# EAGLE design Memory V1.3 (EAGLE 9.6.2)

## Sheet 1 of 6: BUS
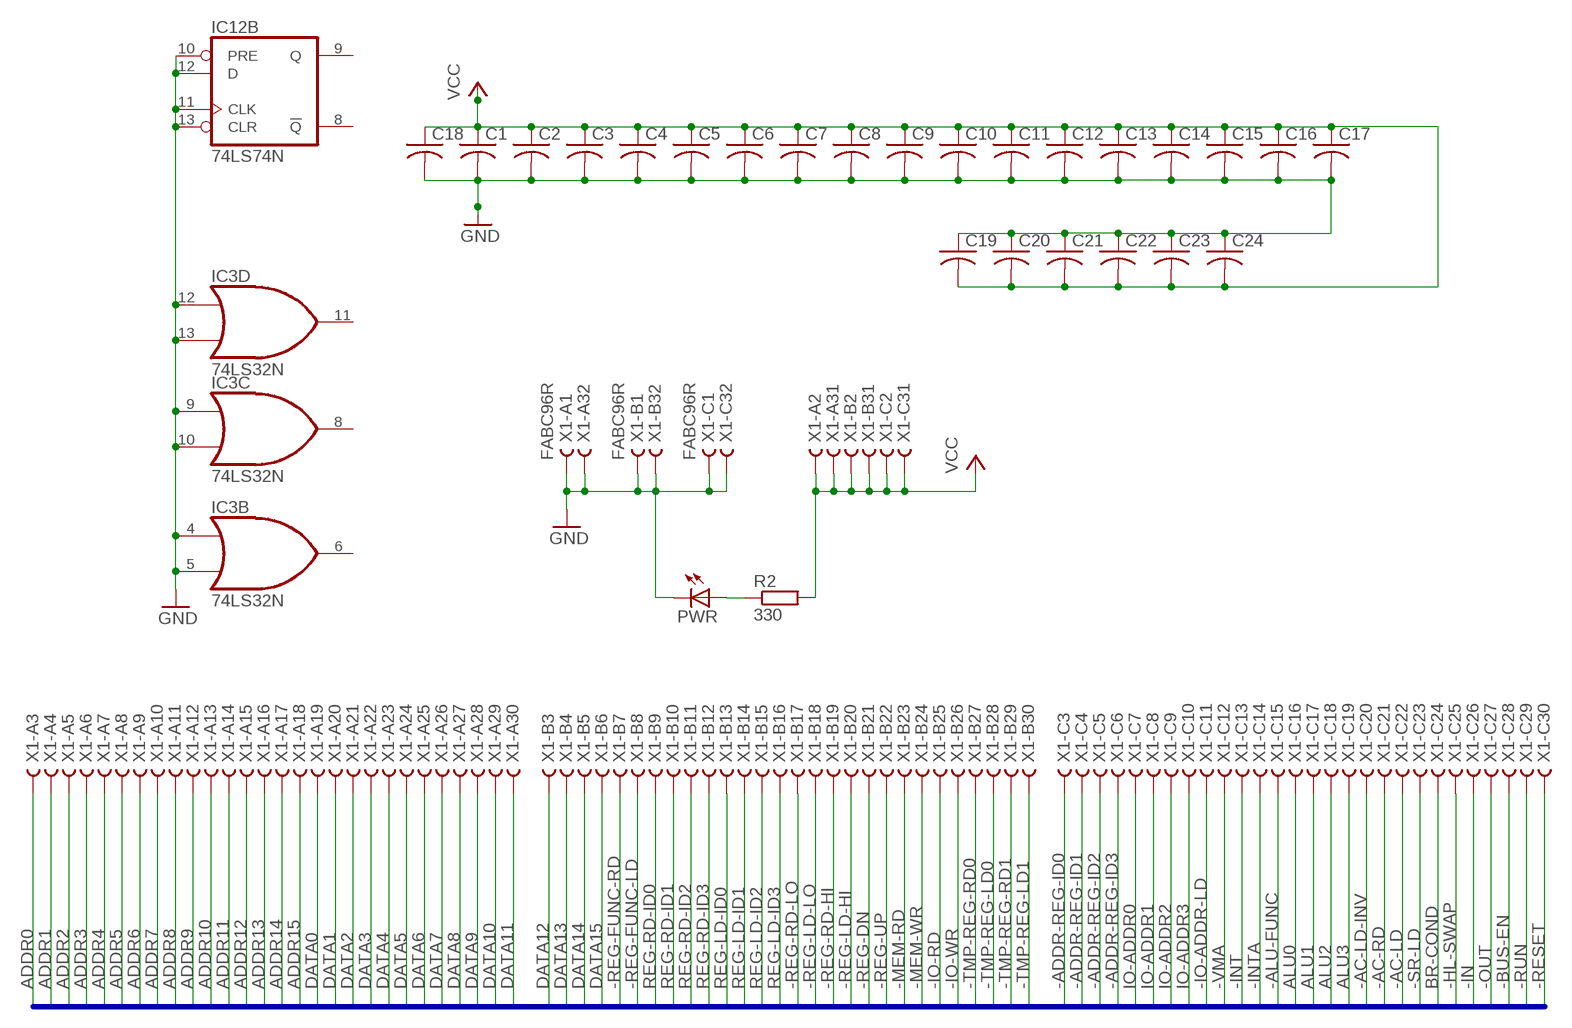
[diagram p0: schematic, sheet 1]

### Parts
C1  C-US025-025X050  [C025-025X050]
C2  C-US025-025X050  [C025-025X050]
C3  C-US025-025X050  [C025-025X050]
C4  C-US025-025X050  [C025-025X050]
C5  C-US025-025X050  [C025-025X050]
C6  C-US025-025X050  [C025-025X050]
C7  C-US025-025X050  [C025-025X050]
C8  C-US025-025X050  [C025-025X050]
C9  C-US025-025X050  [C025-025X050]
C10  C-US025-025X050  [C025-025X050]
C11  C-US025-025X050  [C025-025X050]
C12  C-US025-025X050  [C025-025X050]
C13  C-US025-025X050  [C025-025X050]
C14  C-US025-025X050  [C025-025X050]
C15  C-US025-025X050  [C025-025X050]
C16  C-US025-025X050  [C025-025X050]
C17  C-US025-025X050  [C025-025X050]
C18  C-US025-025X050  [C025-025X050]
C19  C-US025-025X050  [C025-025X050]
C20  C-US025-025X050  [C025-025X050]
C21  C-US025-025X050  [C025-025X050]
C22  C-US025-025X050  [C025-025X050]
C23  C-US025-025X050  [C025-025X050]
C24  C-US025-025X050  [C025-025X050]
IC3  74LS32N  [DIL14]
IC12  74LS74N  [DIL14]
PWR  LED5MM  [LED5MM]
R2  330  R0207/10  [0207/10]
X1  FABC96R  [FABC96R]

### Nets
-AC-LD: X1.C22
-AC-LD-INV: X1.C20
-AC-RD: X1.C21
-ADDR-REG-ID0: X1.C3
-ADDR-REG-ID1: X1.C4
-ADDR-REG-ID2: X1.C5
-ADDR-REG-ID3: X1.C6
-ALU-FUNC: X1.C15
-BUS-EN: X1.C28 ; also sheet 2
-HL-SWAP: X1.C25
-IN: X1.C26
-INT: X1.C13
-INTA: X1.C14
-IO-ADDR-LD: X1.C11
-IO-RD: X1.B25
-IO-WR: X1.B26
-MEM-RD: X1.B23 ; also sheet 3,5
-MEM-WR: X1.B24 ; also sheet 3
-OUT: X1.C27
-REG-DN: X1.B21
-REG-FUNC-LD: X1.B8
-REG-FUNC-RD: X1.B7
-REG-LD-HI: X1.B20
-REG-LD-LO: X1.B18
-REG-RD-HI: X1.B19
-REG-RD-LO: X1.B17
-REG-UP: X1.B22
-RESET: X1.C30 ; also sheet 2
-RUN: X1.C29
-SR-LD: X1.C23
-TMP-REG-LD0: X1.B28 ; also sheet 6
-TMP-REG-LD1: X1.B30 ; also sheet 6
-TMP-REG-RD0: X1.B27 ; also sheet 6
-TMP-REG-RD1: X1.B29 ; also sheet 6
-VMA: X1.C12 ; also sheet 2,3,5
ADDR0: X1.A3 ; also sheet 4
ADDR1: X1.A4 ; also sheet 4
ADDR2: X1.A5 ; also sheet 4
ADDR3: X1.A6 ; also sheet 4
ADDR4: X1.A7 ; also sheet 4
ADDR5: X1.A8 ; also sheet 4
ADDR6: X1.A9 ; also sheet 4
ADDR7: X1.A10 ; also sheet 4
ADDR8: X1.A11 ; also sheet 4
ADDR9: X1.A12 ; also sheet 4
ADDR10: X1.A13 ; also sheet 4
ADDR11: X1.A14 ; also sheet 4
ADDR12: X1.A15 ; also sheet 4
ADDR13: X1.A16 ; also sheet 4
ADDR14: X1.A17 ; also sheet 4
ADDR15: X1.A18 ; also sheet 2,4
ALU0: X1.C16
ALU1: X1.C17
ALU2: X1.C18
ALU3: X1.C19
BR-COND: X1.C24
DATA0: X1.A19 ; also sheet 5,6
DATA1: X1.A20 ; also sheet 5,6
DATA2: X1.A21 ; also sheet 5,6
DATA3: X1.A22 ; also sheet 5,6
DATA4: X1.A23 ; also sheet 5,6
DATA5: X1.A24 ; also sheet 5,6
DATA6: X1.A25 ; also sheet 5,6
DATA7: X1.A26 ; also sheet 5,6
DATA8: X1.A27 ; also sheet 6
DATA9: X1.A28 ; also sheet 6
DATA10: X1.A29 ; also sheet 6
DATA11: X1.A30 ; also sheet 6
DATA12: X1.B3 ; also sheet 6
DATA13: X1.B4 ; also sheet 6
DATA14: X1.B5 ; also sheet 6
DATA15: X1.B6 ; also sheet 6
GND: C1.2 C2.2 C3.2 C4.2 C5.2 C6.2 C7.2 C8.2 C9.2 C10.2 C11.2 C12.2 C13.2 C14.2 C15.2 C16.2 C17.2 C18.2 C19.1 C20.1 C21.1 C22.1 C23.1 C24.1 IC3.4(B:I0) IC3.5(B:I1) IC3.9(C:I0) IC3.10(C:I1) IC3.12(D:I0) IC3.13(D:I1) IC12.10(B:PRE) IC12.11(B:CLK) IC12.12(B:D) IC12.13(B:CLR) PWR.K(C) X1.A1 X1.A32 X1.B1 X1.B32 X1.C1 X1.C32 ; also sheet 2,3,4,6
IO-ADDR0: X1.C7
IO-ADDR1: X1.C8
IO-ADDR2: X1.C9
IO-ADDR3: X1.C10
N$11: PWR.A R2.1
REG-LD-ID0: X1.B13
REG-LD-ID1: X1.B14
REG-LD-ID2: X1.B15
REG-LD-ID3: X1.B16
REG-RD-ID0: X1.B9
REG-RD-ID1: X1.B10
REG-RD-ID2: X1.B11
REG-RD-ID3: X1.B12
VCC: C1.1 C2.1 C3.1 C4.1 C5.1 C6.1 C7.1 C8.1 C9.1 C10.1 C11.1 C12.1 C13.1 C14.1 C15.1 C16.1 C17.1 C18.1 C19.2 C20.2 C21.2 C22.2 C23.2 C24.2 R2.2 X1.A2 X1.A31 X1.B2 X1.B31 X1.C2 X1.C31 ; also sheet 2,3,4
Unconnected: IC3.6(B:O) IC3.8(C:O) IC3.11(D:O) IC12.8(B:!Q) IC12.9(B:Q)

### Buses
MAINBUS:-AC-LD,-AC-LD-INV,-AC-RD,ADDR[0..15],-ADDR-REG-LD[0..1],-ADDR-REG-RD[0..1],ALU[0..3],-ALU-FUNC,BR-COND,-BUS-EN,DATA[0..15],-HL-SWAP,-IN,-INT,-INTA,IO-ADDR[0..3],-IO-ADDR-LD,-IO-RD,-IO-WR,-MEM-RD,-MEM-WR,-OUT,-REG-DN,-REG-FUNC-LD,-REG-FUNC-RD,-REG-LD-HI,REG-LD-ID[0..3],-REG-LD-LO,-REG-RD-HI,REG-RD-ID[0..3],-REG-RD-LO,-REG-UP,-RESET,-RUN,-SR-LD,-TMP-REG-LD[0..1],-TMP-REG-RD[0..1],-VMA

## Sheet 2 of 6: Memory Select
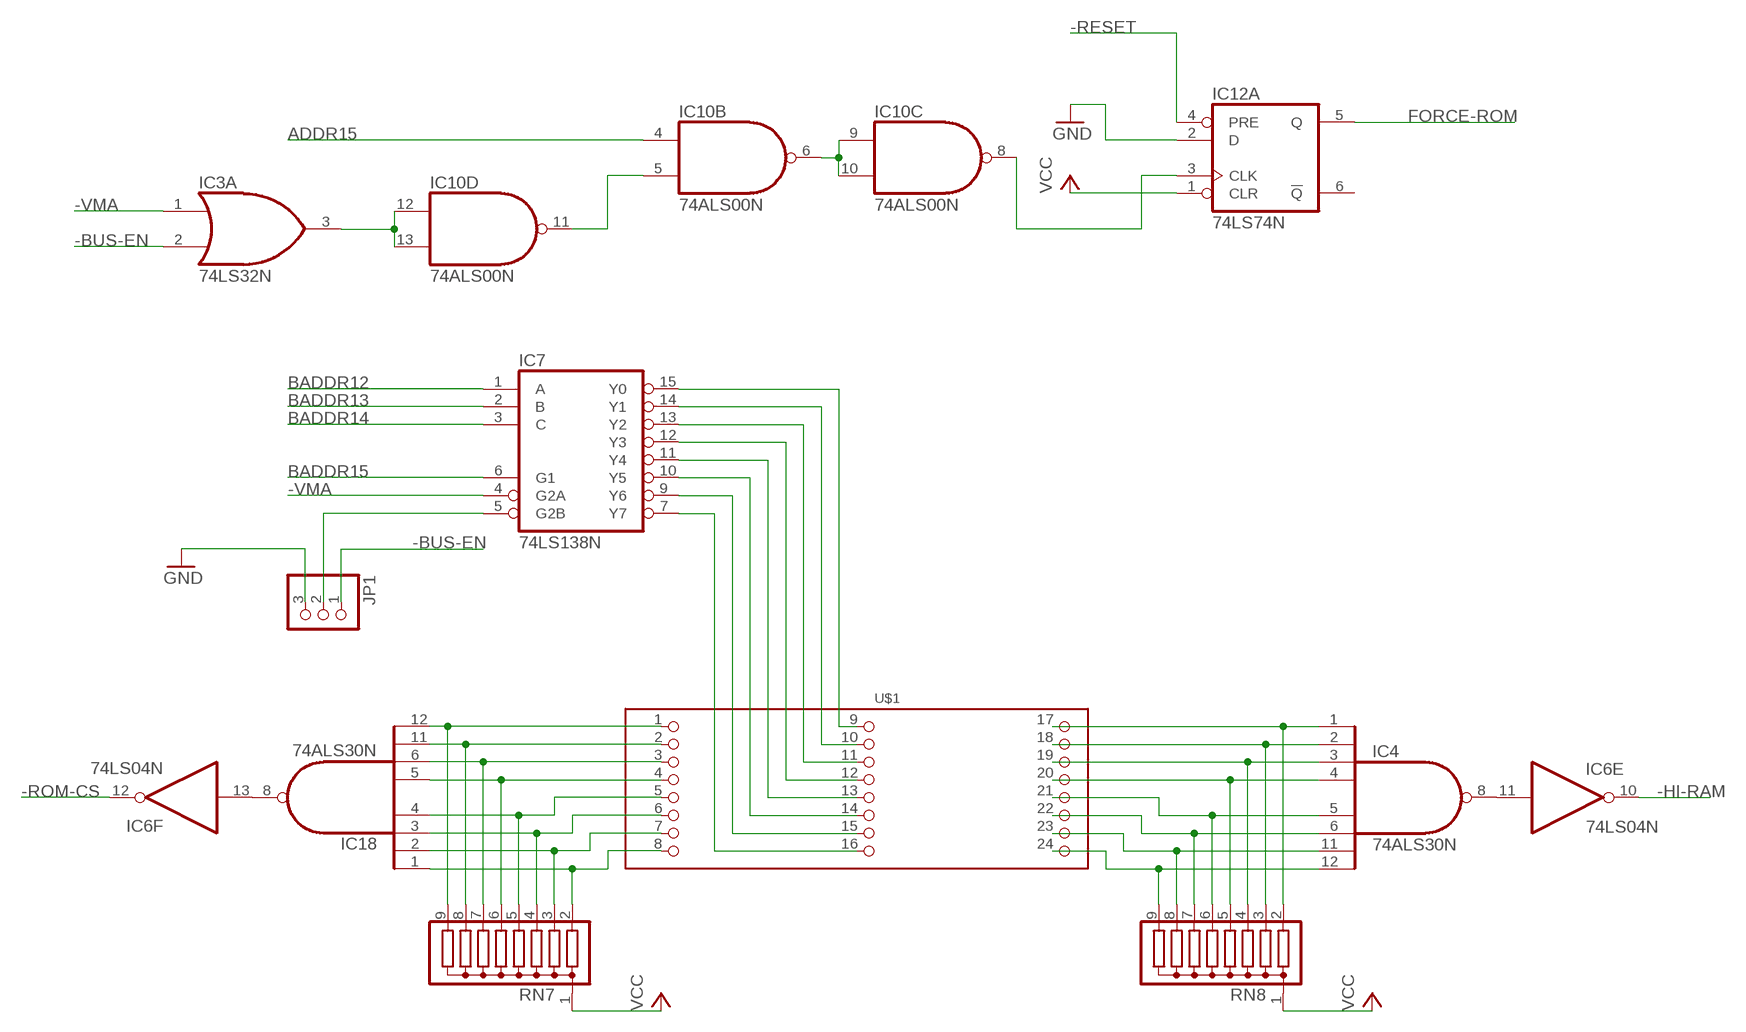
[diagram p1: schematic, sheet 2]

### Parts
IC4  74ALS30N  [DIL14]
IC6  74LS04N  [DIL14]
IC7  74LS138N  [DIL16]
IC10  74ALS00N  [DIL14]
IC18  74ALS30N  [DIL14]
JP1  PINHD-1X3  [1X03]
RN7  G08R  [SIL9]
RN8  G08R  [SIL9]
U$1  PIN_3X8  [PIN_3X8]

### Nets
-BUS-EN: IC3.2(A:I1) JP1.1 ; also sheet 1
-HI-RAM: IC6.10(E:O) ; also sheet 3
-RESET: IC12.4(A:PRE) ; also sheet 1
-ROM-CS: IC6.12(F:O) ; also sheet 3
-VMA: IC3.1(A:I0) IC7.4(G2A) ; also sheet 1,3,5
ADDR15: IC10.4(B:I0) ; also sheet 1,4
BADDR12: IC7.1(A) ; also sheet 3,4
BADDR13: IC7.2(B) ; also sheet 3,4
BADDR14: IC7.3(C) ; also sheet 3,4
BADDR15: IC7.6(G1) ; also sheet 3,4
FORCE-ROM: IC12.5(A:Q) ; also sheet 4
GND: IC12.2(A:D) JP1.3 ; also sheet 1,3,4,6
N$1: IC6.13(F:I) IC18.8(O)
N$5: IC4.1(I0) RN8.2 U$1.17
N$6: IC4.2(I1) RN8.3 U$1.18
N$7: IC4.3(I2) RN8.4 U$1.19
N$8: IC4.4(I3) RN8.5 U$1.20
N$9: IC4.5(I4) RN8.6 U$1.21
N$10: IC4.6(I5) RN8.7 U$1.22
N$14: IC4.8(O) IC6.11(E:I)
N$19: IC10.8(C:O) IC12.3(A:CLK)
N$20: IC10.6(B:O) IC10.9(C:I0) IC10.10(C:I1)
N$22: IC10.5(B:I1) IC10.11(D:O)
N$24: IC7.5(G2B) JP1.2
N$25: IC3.3(A:O) IC10.12(D:I0) IC10.13(D:I1)
N$26: IC4.11(I6) RN8.8 U$1.23
N$27: IC4.12(I7) RN8.9 U$1.24
N$28: IC18.12(I7) RN7.9 U$1.1
N$29: IC18.11(I6) RN7.8 U$1.2
N$30: IC18.6(I5) RN7.7 U$1.3
N$31: IC18.5(I4) RN7.6 U$1.4
N$32: IC18.1(I0) RN7.2 U$1.8
N$34: IC18.2(I1) RN7.3 U$1.7
N$35: IC18.3(I2) RN7.4 U$1.6
N$36: IC7.7(Y7) U$1.16
N$37: IC7.9(Y6) U$1.15
N$38: IC7.10(Y5) U$1.14
N$39: IC7.11(Y4) U$1.13
N$40: IC7.12(Y3) U$1.12
N$41: IC7.13(Y2) U$1.11
N$42: IC7.14(Y1) U$1.10
N$43: IC7.15(Y0) U$1.9
N$44: IC18.4(I3) RN7.5 U$1.5
VCC: IC12.1(A:CLR) RN7.1 RN8.1 ; also sheet 1,3,4
Unconnected: IC12.6(A:!Q)

## Sheet 3 of 6: Memory
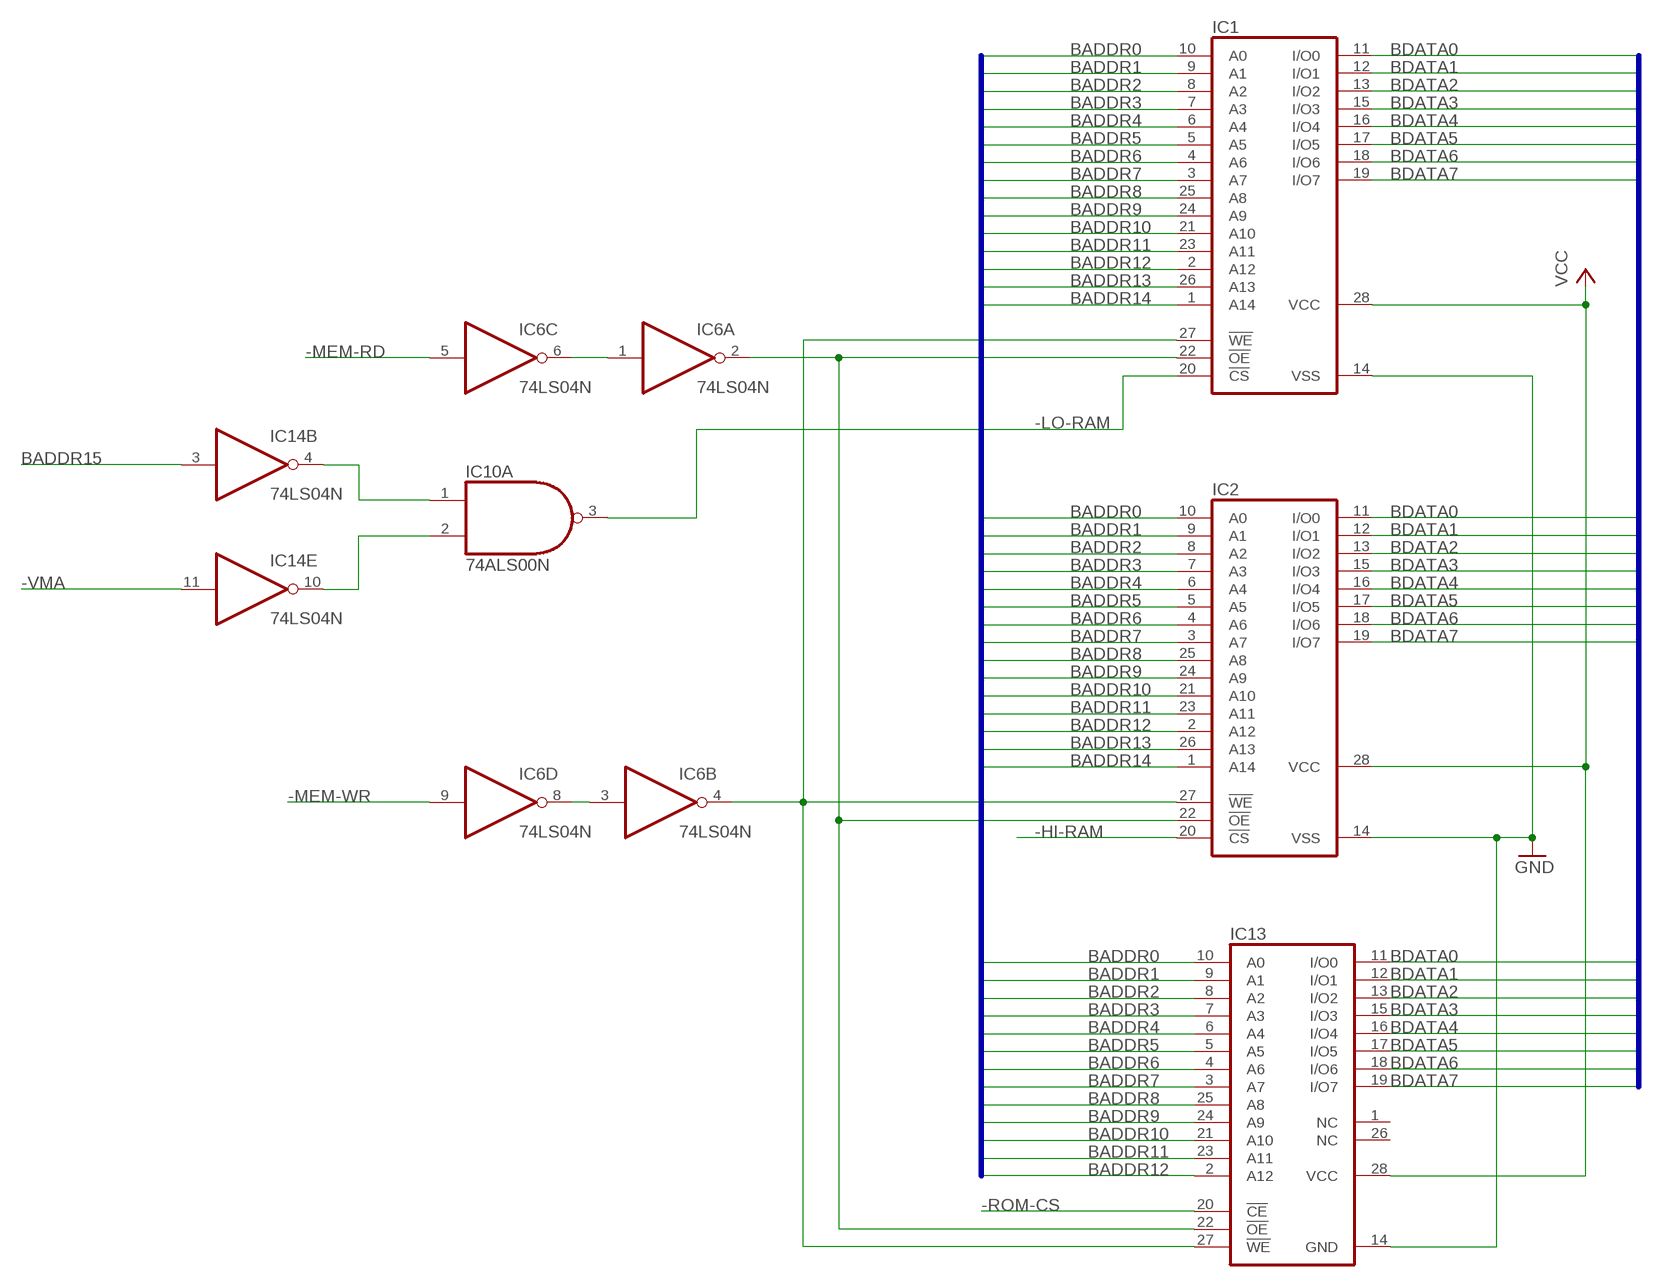
[diagram p2: schematic, sheet 3]

### Parts
IC1  62256P  [DIL28-6]
IC2  62256P  [DIL28-6]
IC13  28C64C  [DIL28-6]
IC14  74LS04N  [DIL14]

### Nets
-HI-RAM: IC2.20(!CS) ; also sheet 2
-LO-RAM: IC1.20(!CS) IC10.3(A:O)
-MEM-RD: IC6.5(C:I) ; also sheet 1,5
-MEM-WR: IC6.9(D:I) ; also sheet 1
-ROM-CS: IC13.20(!CE) ; also sheet 2
-VMA: IC14.11(E:I) ; also sheet 1,2,5
BADDR0: IC1.10(A0) IC2.10(A0) IC13.10(A0) ; also sheet 4
BADDR1: IC1.9(A1) IC2.9(A1) IC13.9(A1) ; also sheet 4
BADDR2: IC1.8(A2) IC2.8(A2) IC13.8(A2) ; also sheet 4
BADDR3: IC1.7(A3) IC2.7(A3) IC13.7(A3) ; also sheet 4
BADDR4: IC1.6(A4) IC2.6(A4) IC13.6(A4) ; also sheet 4
BADDR5: IC1.5(A5) IC2.5(A5) IC13.5(A5) ; also sheet 4
BADDR6: IC1.4(A6) IC2.4(A6) IC13.4(A6) ; also sheet 4
BADDR7: IC1.3(A7) IC2.3(A7) IC13.3(A7) ; also sheet 4
BADDR8: IC1.25(A8) IC2.25(A8) IC13.25(A8) ; also sheet 4
BADDR9: IC1.24(A9) IC2.24(A9) IC13.24(A9) ; also sheet 4
BADDR10: IC1.21(A10) IC2.21(A10) IC13.21(A10) ; also sheet 4
BADDR11: IC1.23(A11) IC2.23(A11) IC13.23(A11) ; also sheet 4
BADDR12: IC1.2(A12) IC2.2(A12) IC13.2(A12) ; also sheet 2,4
BADDR13: IC1.26(A13) IC2.26(A13) ; also sheet 2,4
BADDR14: IC1.1(A14) IC2.1(A14) ; also sheet 2,4
BADDR15: IC14.3(B:I) ; also sheet 2,4
BDATA0: IC1.11(I/O0) IC2.11(I/O0) IC13.11(I/O0) ; also sheet 5
BDATA1: IC1.12(I/O1) IC2.12(I/O1) IC13.12(I/O1) ; also sheet 5
BDATA2: IC1.13(I/O2) IC2.13(I/O2) IC13.13(I/O2) ; also sheet 5
BDATA3: IC1.15(I/O3) IC2.15(I/O3) IC13.15(I/O3) ; also sheet 5
BDATA4: IC1.16(I/O4) IC2.16(I/O4) IC13.16(I/O4) ; also sheet 5
BDATA5: IC1.17(I/O5) IC2.17(I/O5) IC13.17(I/O5) ; also sheet 5
BDATA6: IC1.18(I/O6) IC2.18(I/O6) IC13.18(I/O6) ; also sheet 5
BDATA7: IC1.19(I/O7) IC2.19(I/O7) IC13.19(I/O7) ; also sheet 5
GND: IC1.14(VSS) IC2.14(VSS) IC13.14(GND) ; also sheet 1,2,4,6
MEM-RD: IC6.1(A:I) IC6.6(C:O)
N$2: IC6.3(B:I) IC6.8(D:O)
N$3: IC1.22(!OE) IC2.22(!OE) IC6.2(A:O) IC13.22(!OE)
N$4: IC1.27(!WE) IC2.27(!WE) IC6.4(B:O) IC13.27(!WE)
N$12: IC10.2(A:I1) IC14.10(E:O)
N$13: IC10.1(A:I0) IC14.4(B:O)
VCC: IC1.28(VCC) IC2.28(VCC) IC13.28(VCC) ; also sheet 1,2,4
Unconnected: IC13.1(NC) IC13.26(NC) IC14.5(C:I) IC14.6(C:O) IC14.8(D:O) IC14.9(D:I)

### Buses
BADDR[0..15]
BDATA[0..7]

## Sheet 4 of 6: Adress Buffering
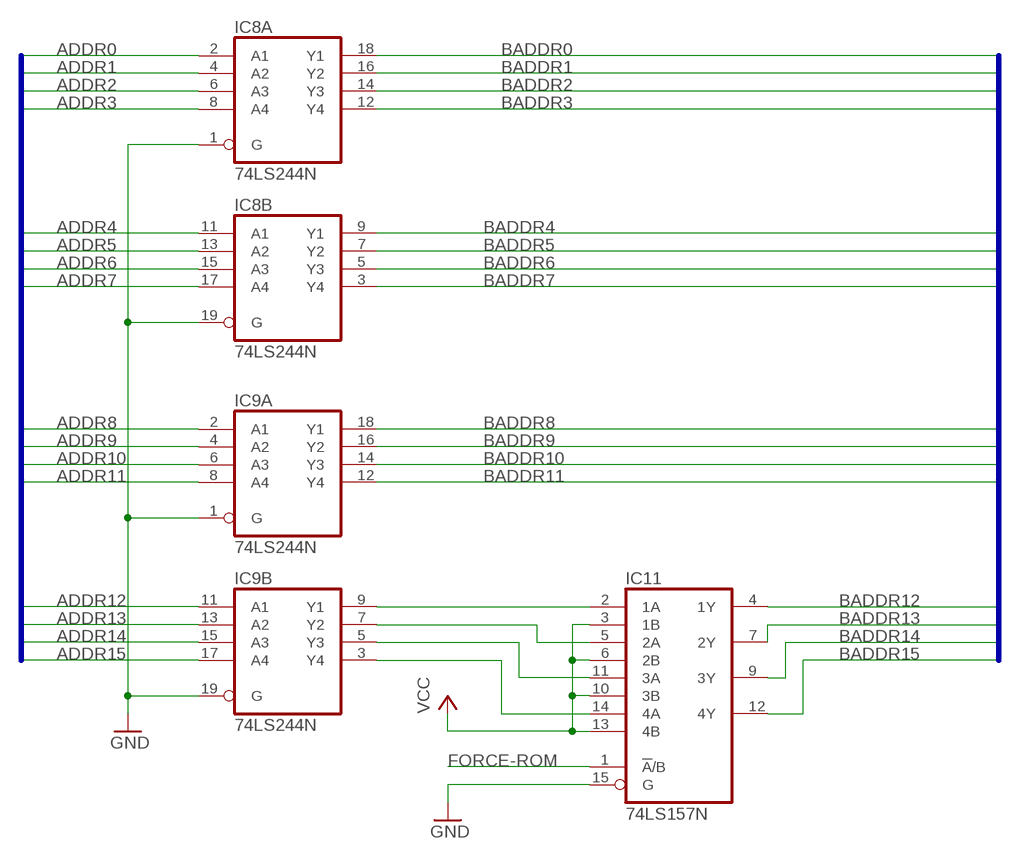
[diagram p3: schematic, sheet 4]

### Parts
IC8  74LS244N  [DIL20]
IC9  74LS244N  [DIL20]
IC11  74LS157N  [DIL16]

### Nets
ADDR0: IC8.2(A:A1) ; also sheet 1
ADDR1: IC8.4(A:A2) ; also sheet 1
ADDR2: IC8.6(A:A3) ; also sheet 1
ADDR3: IC8.8(A:A4) ; also sheet 1
ADDR4: IC8.11(B:A1) ; also sheet 1
ADDR5: IC8.13(B:A2) ; also sheet 1
ADDR6: IC8.15(B:A3) ; also sheet 1
ADDR7: IC8.17(B:A4) ; also sheet 1
ADDR8: IC9.2(A:A1) ; also sheet 1
ADDR9: IC9.4(A:A2) ; also sheet 1
ADDR10: IC9.6(A:A3) ; also sheet 1
ADDR11: IC9.8(A:A4) ; also sheet 1
ADDR12: IC9.11(B:A1) ; also sheet 1
ADDR13: IC9.13(B:A2) ; also sheet 1
ADDR14: IC9.15(B:A3) ; also sheet 1
ADDR15: IC9.17(B:A4) ; also sheet 1,2
BADDR0: IC8.18(A:Y1) ; also sheet 3
BADDR1: IC8.16(A:Y2) ; also sheet 3
BADDR2: IC8.14(A:Y3) ; also sheet 3
BADDR3: IC8.12(A:Y4) ; also sheet 3
BADDR4: IC8.9(B:Y1) ; also sheet 3
BADDR5: IC8.7(B:Y2) ; also sheet 3
BADDR6: IC8.5(B:Y3) ; also sheet 3
BADDR7: IC8.3(B:Y4) ; also sheet 3
BADDR8: IC9.18(A:Y1) ; also sheet 3
BADDR9: IC9.16(A:Y2) ; also sheet 3
BADDR10: IC9.14(A:Y3) ; also sheet 3
BADDR11: IC9.12(A:Y4) ; also sheet 3
BADDR12: IC11.4(1Y) ; also sheet 2,3
BADDR13: IC11.7(2Y) ; also sheet 2,3
BADDR14: IC11.9(3Y) ; also sheet 2,3
BADDR15: IC11.12(4Y) ; also sheet 2,3
FORCE-ROM: IC11.1(!A!/B) ; also sheet 2
GND: IC8.1(A:G) IC8.19(B:G) IC9.1(A:G) IC9.19(B:G) IC11.15(G) ; also sheet 1,2,3,6
N$15: IC9.9(B:Y1) IC11.2(1A)
N$16: IC9.7(B:Y2) IC11.5(2A)
N$17: IC9.5(B:Y3) IC11.11(3A)
N$18: IC9.3(B:Y4) IC11.14(4A)
VCC: IC11.3(1B) IC11.6(2B) IC11.10(3B) IC11.13(4B) ; also sheet 1,2,3

### Buses
ADDR0,ADDR1,ADDR2,ADDR3,ADDR4,ADDR5,ADDR6,ADDR7,ADDR8,ADDR9,ADDR10,ADDR11,ADDR12,ADDR13,ADDR14,ADDR15
BADDR[0..15]

## Sheet 5 of 6: Data Buffer
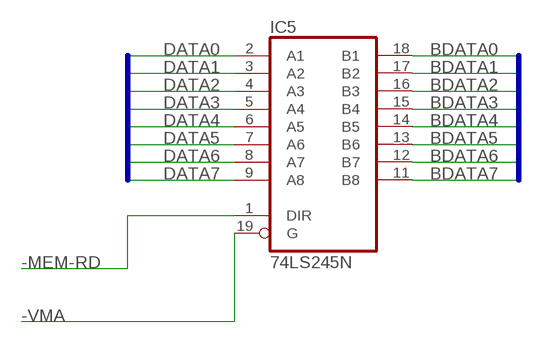
[diagram p4: schematic, sheet 5]

### Parts
IC5  74LS245N  [DIL20]

### Nets
-MEM-RD: IC5.1(DIR) ; also sheet 1,3
-VMA: IC5.19(G) ; also sheet 1,2,3
BDATA0: IC5.18(B1) ; also sheet 3
BDATA1: IC5.17(B2) ; also sheet 3
BDATA2: IC5.16(B3) ; also sheet 3
BDATA3: IC5.15(B4) ; also sheet 3
BDATA4: IC5.14(B5) ; also sheet 3
BDATA5: IC5.13(B6) ; also sheet 3
BDATA6: IC5.12(B7) ; also sheet 3
BDATA7: IC5.11(B8) ; also sheet 3
DATA0: IC5.2(A1) ; also sheet 1,6
DATA1: IC5.3(A2) ; also sheet 1,6
DATA2: IC5.4(A3) ; also sheet 1,6
DATA3: IC5.5(A4) ; also sheet 1,6
DATA4: IC5.6(A5) ; also sheet 1,6
DATA5: IC5.7(A6) ; also sheet 1,6
DATA6: IC5.8(A7) ; also sheet 1,6
DATA7: IC5.9(A8) ; also sheet 1,6

### Buses
DATA[0..7]
BDATA0,BDATA1,BDATA2,BDATA3,BDATA4,BDATA5,BDATA6,BDATA7

## Sheet 6 of 6
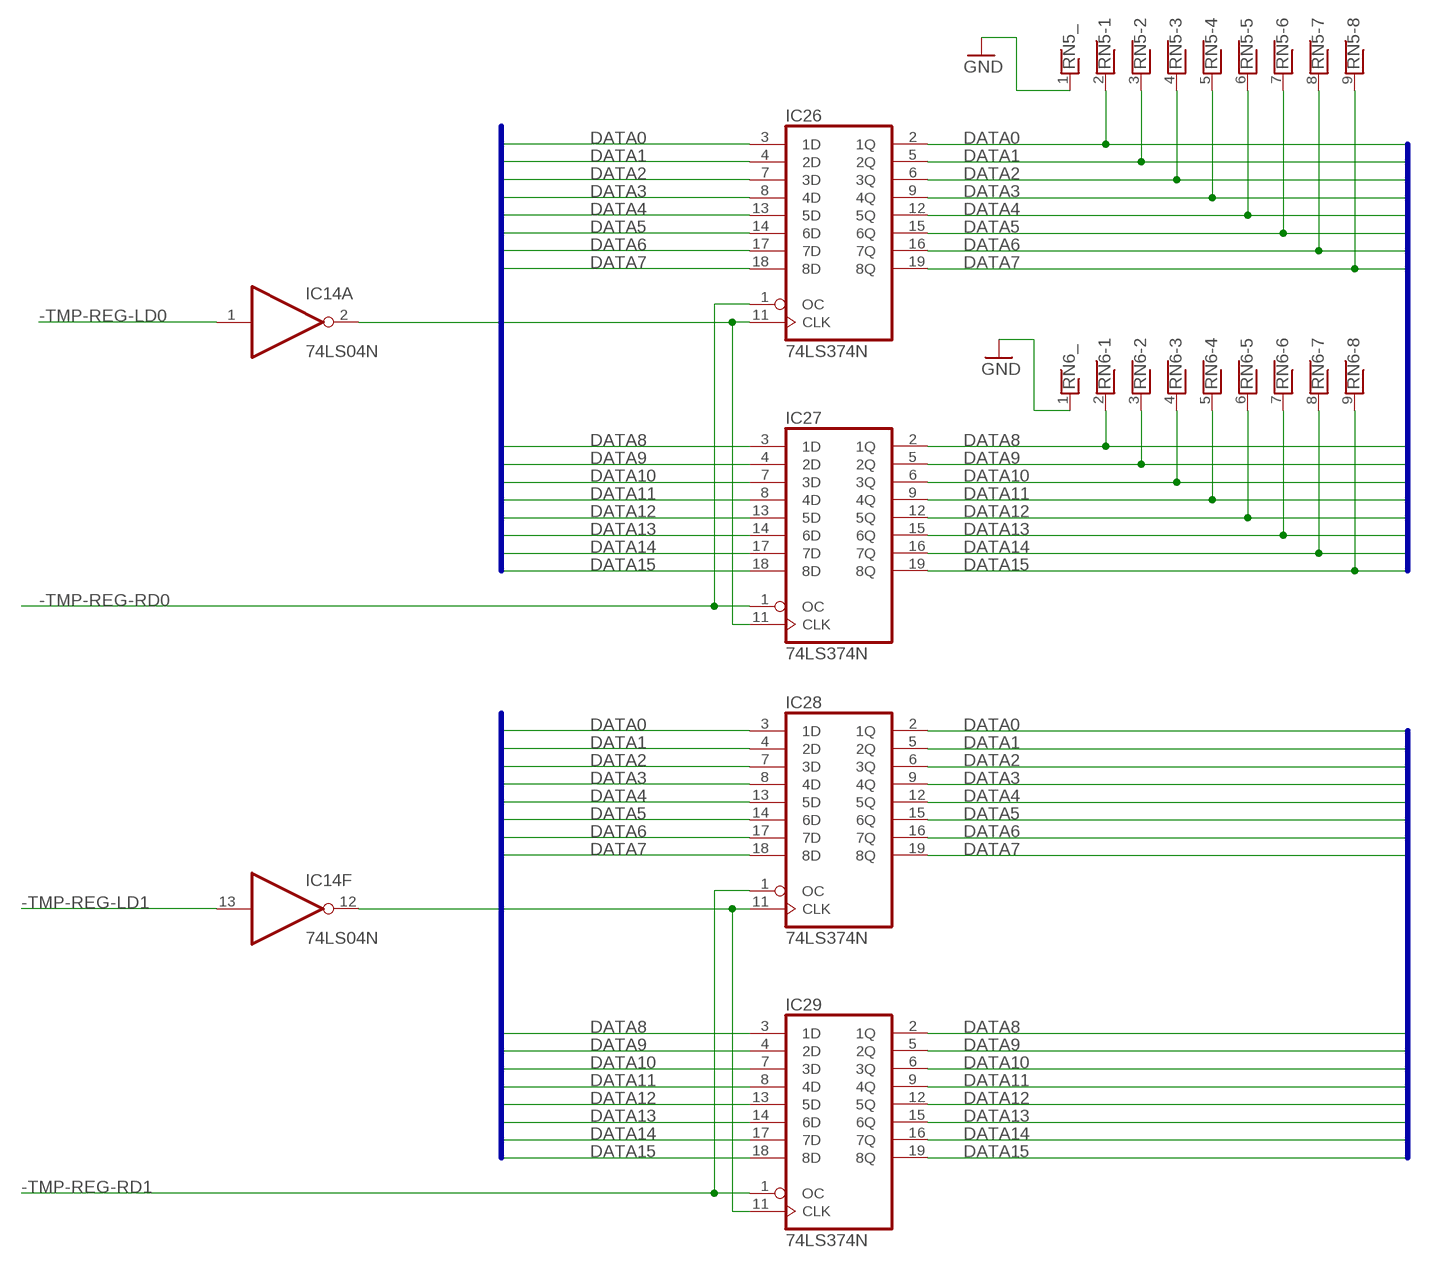
[diagram p5: schematic, sheet 6]

### Parts
IC26  74LS374N  [DIL20]
IC27  74LS374N  [DIL20]
IC28  74LS374N  [DIL20]
IC29  74LS374N  [DIL20]
RN5  RNX8  [RN-9]
RN6  RNX8  [RN-9]

### Nets
-TMP-REG-LD0: IC14.1(A:I) ; also sheet 1
-TMP-REG-LD1: IC14.13(F:I) ; also sheet 1
-TMP-REG-RD0: IC26.1(OC) IC27.1(OC) ; also sheet 1
-TMP-REG-RD1: IC28.1(OC) IC29.1(OC) ; also sheet 1
DATA0: IC26.2(1Q) IC26.3(1D) IC28.2(1Q) IC28.3(1D) RN5.2 ; also sheet 1,5
DATA1: IC26.4(2D) IC26.5(2Q) IC28.4(2D) IC28.5(2Q) RN5.3 ; also sheet 1,5
DATA2: IC26.6(3Q) IC26.7(3D) IC28.6(3Q) IC28.7(3D) RN5.4 ; also sheet 1,5
DATA3: IC26.8(4D) IC26.9(4Q) IC28.8(4D) IC28.9(4Q) RN5.5 ; also sheet 1,5
DATA4: IC26.12(5Q) IC26.13(5D) IC28.12(5Q) IC28.13(5D) RN5.6 ; also sheet 1,5
DATA5: IC26.14(6D) IC26.15(6Q) IC28.14(6D) IC28.15(6Q) RN5.7 ; also sheet 1,5
DATA6: IC26.16(7Q) IC26.17(7D) IC28.16(7Q) IC28.17(7D) RN5.8 ; also sheet 1,5
DATA7: IC26.18(8D) IC26.19(8Q) IC28.18(8D) IC28.19(8Q) RN5.9 ; also sheet 1,5
DATA8: IC27.2(1Q) IC27.3(1D) IC29.2(1Q) IC29.3(1D) RN6.2 ; also sheet 1
DATA9: IC27.4(2D) IC27.5(2Q) IC29.4(2D) IC29.5(2Q) RN6.3 ; also sheet 1
DATA10: IC27.6(3Q) IC27.7(3D) IC29.6(3Q) IC29.7(3D) RN6.4 ; also sheet 1
DATA11: IC27.8(4D) IC27.9(4Q) IC29.8(4D) IC29.9(4Q) RN6.5 ; also sheet 1
DATA12: IC27.12(5Q) IC27.13(5D) IC29.12(5Q) IC29.13(5D) RN6.6 ; also sheet 1
DATA13: IC27.14(6D) IC27.15(6Q) IC29.14(6D) IC29.15(6Q) RN6.7 ; also sheet 1
DATA14: IC27.16(7Q) IC27.17(7D) IC29.16(7Q) IC29.17(7D) RN6.8 ; also sheet 1
DATA15: IC27.18(8D) IC27.19(8Q) IC29.18(8D) IC29.19(8Q) RN6.9 ; also sheet 1
GND: RN5.1 RN6.1 ; also sheet 1,2,3,4
N$33: IC14.2(A:O) IC26.11(CLK) IC27.11(CLK)
N$47: IC14.12(F:O) IC28.11(CLK) IC29.11(CLK)

### Buses
DATABUS:DATA[0..15]

## Power pins joined to a net without a drawn wire
GND: IC3.7(P:GND) IC4.7(GND) IC5.10(GND) IC6.7(P:GND) IC7.8(GND) IC8.10(P:GND) IC9.10(P:GND) IC10.7(P:GND) IC11.8(GND) IC12.7(P:GND) IC14.7(P:GND) IC18.7(GND) IC26.10(GND) IC27.10(GND) IC28.10(GND) IC29.10(GND)
VCC: IC3.14(P:VCC) IC4.14(VCC) IC5.20(VCC) IC6.14(P:VCC) IC7.16(VCC) IC8.20(P:VCC) IC9.20(P:VCC) IC10.14(P:VCC) IC11.16(VCC) IC12.14(P:VCC) IC14.14(P:VCC) IC18.14(VCC) IC26.20(VCC) IC27.20(VCC) IC28.20(VCC) IC29.20(VCC)

## Library data of the parts
C1-C24 = adafruit:C-US: CAPACITOR, American symbol
IC1 IC2 = memory-hitachi:62256P: MEMORY; OC_FARNELL: unknown; OC_NEWARK: unknown
IC3 = 74xx-us:74*32: Quad 2-input OR gate
IC4 IC18 = 74xx-us:74*30: 8-input NAND gate
IC5 = adafruit:74*245: Octal BUS TRANSCEIVER, 3-state
IC6 IC14 = 74xx-us:74*04: Hex INVERTER
IC7 = 74xx-us:74*138: 3-line to 8-line DECODER/DEMULTIPLEXER
IC8 IC9 = 74xx-us:74*244: Octal BUFFER and LINE DRIVER, 3-state
IC10 = 74xx-us:74*00: Quad 2-input NAND gate
IC11 = 74xx-us:74*157: Quadruple 2-line to 1-line data SELECTOR/MULTIPLEXER
IC12 = 74xx-us:74*74: Dual D type positive edge triggered FLIP FLOP, preset and clear
IC13 = memory-nec:28C64C: MEMORY; MPN: AT28C64B-15PU; OC_FARNELL: 1095784; OC_NEWARK: 96K6557
IC26-IC29 = 74xx-us:74*374: Octal D type transparent LATCH, edge triggered
JP1 = pinhead:PINHD-1X3: PIN HEADER
PWR = led:LED: LED OSRAM: - CHIPLED LG R971, LG N971, LY N971, LG Q971, LY Q971, LO R971, LY R971 LH N974, LH R974 LS Q976, LO Q976, LY Q976 LO Q996 - Hyper CHIPLED LW Q18S LB Q993, LB Q99A, LB R99A - SideLED LS A670, LO A670, LY A670, LG A670, LP A670 LB A673, LV A673, LT A673, LW A673 LH A674 LY A675 LS A676, LA A676, LO A676, LY A676, LW A676 LS A679, LY A679, LG A679 - Hyper Micro SIDELED® LS Y876, LA Y876, LO Y876, LY Y876 LT Y87S - SmartLED LW L88C, LW L88S LB L89C, LB L89S, LG L890 LS L89K, LO L89K, LY L89K LS L896, LA L896, LO L896, LY L896 - TOPLED LS T670, LO T670, LY T670, LG T670, LP T670 LSG T670, LSP T670, LSY T670, LOP T670, LYG T670 LG T671, LOG T671, LSG T671 LB T673, LV T673, LT T673, LW T673 LH T674 LS T676, LA T676, LO T676, LY T676, LB T676, LH T676, LSB T676, LW T676 LB T67C, LV T67C, LT T67C, LS T67K, LO T67K, LY T67K, LW E67C LS E67B, LA E67B, LO E67B, LY E67B, LB E67C, LV E67C, LT E67C LW T67C LS T679, LY T679, LG T679 LS T770, LO T770, LY T770, LG T770, LP T770 LB T773, LV T773, LT T773, LW T773 LH T774 LS E675, LA E675, LY E675, LS T675 LS T776, LA T776, LO T776, LY T776, LB T776 LHGB T686 LT T68C, LB T68C - Hyper Mini TOPLED® LB M676 - Mini TOPLED Santana® LG M470 LS M47K, LO M47K, LY M47K Source: http://www.osram.convergy.de LUXEON: - LUMILED® LXK2-PW12-R00, LXK2-PW12-S00, LXK2-PW14-U00, LXK2-PW14-V00 LXK2-PM12-R00, LXK2-PM12-S00, LXK2-PM14-U00 LXK2-PE12-Q00, LXK2-PE12-R00, LXK2-PE12-S00, LXK2-PE14-T00, LXK2-PE14-U00 LXK2-PB12-K00, LXK2-PB12-L00, LXK2-PB12-M00, LXK2-PB14-N00, LXK2-PB14-P00, LXK2-PB14-Q00 LXK2-PR12-L00, LXK2-PR12-M00, LXK2-PR14-Q00, LXK2-PR14-R00 LXK2-PD12-Q00, LXK2-PD12-R00, LXK2-PD12-S00 LXK2-PH12-R00, LXK2-PH12-S00 LXK2-PL12-P00, LXK2-PL12-Q00, LXK2-PL12-R00 Source: www.luxeon.com KINGBRIGHT: KA-3528ASYC Source: www.kingbright.com
R2 = eagle-ltspice:R: RESISTOR, European symbol; SPICEMODEL: NONE; SPICEPREFIX: R
RN5 RN6 = resistor-net:RNX8: RESISTOR NETWORK; OC_FARNELL: unknown; OC_NEWARK: unknown
RN7 RN8 = resistor-sil:G08R: SIL RESISTOR; OC_FARNELL: unknown; OC_NEWARK: unknown
U$1 = pinhead_3row:PIN_3X8
X1 = con-vg:FABC96R: CONNECTOR female, 96 pins, type R, rows ABC, grid 2.54 mm

## Net classes
1 GND: width 1 mm
2 5V: width 1 mm

## Board
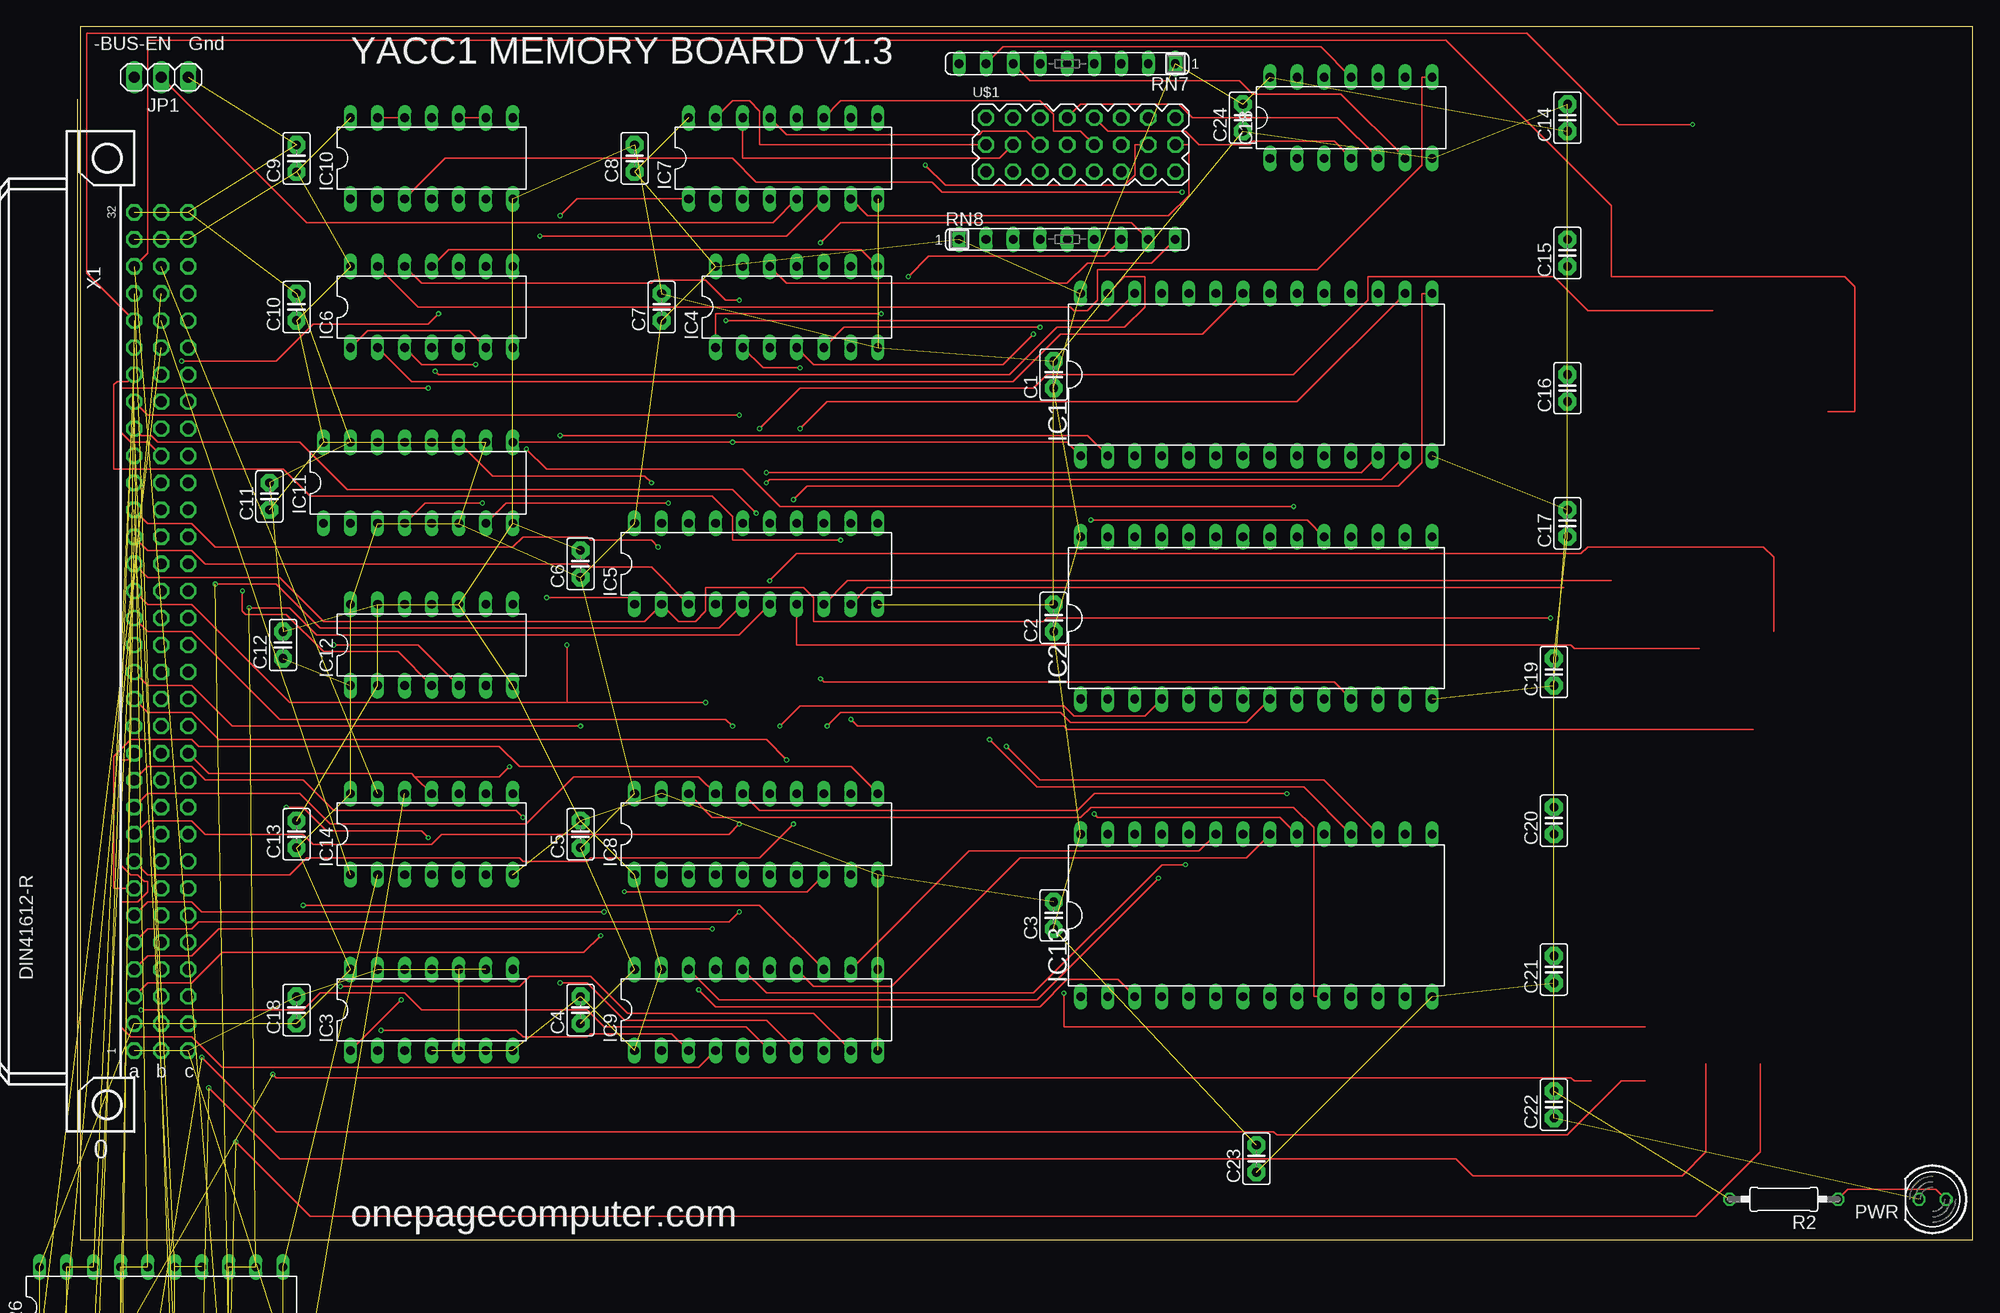
[diagram p6: board, top side]
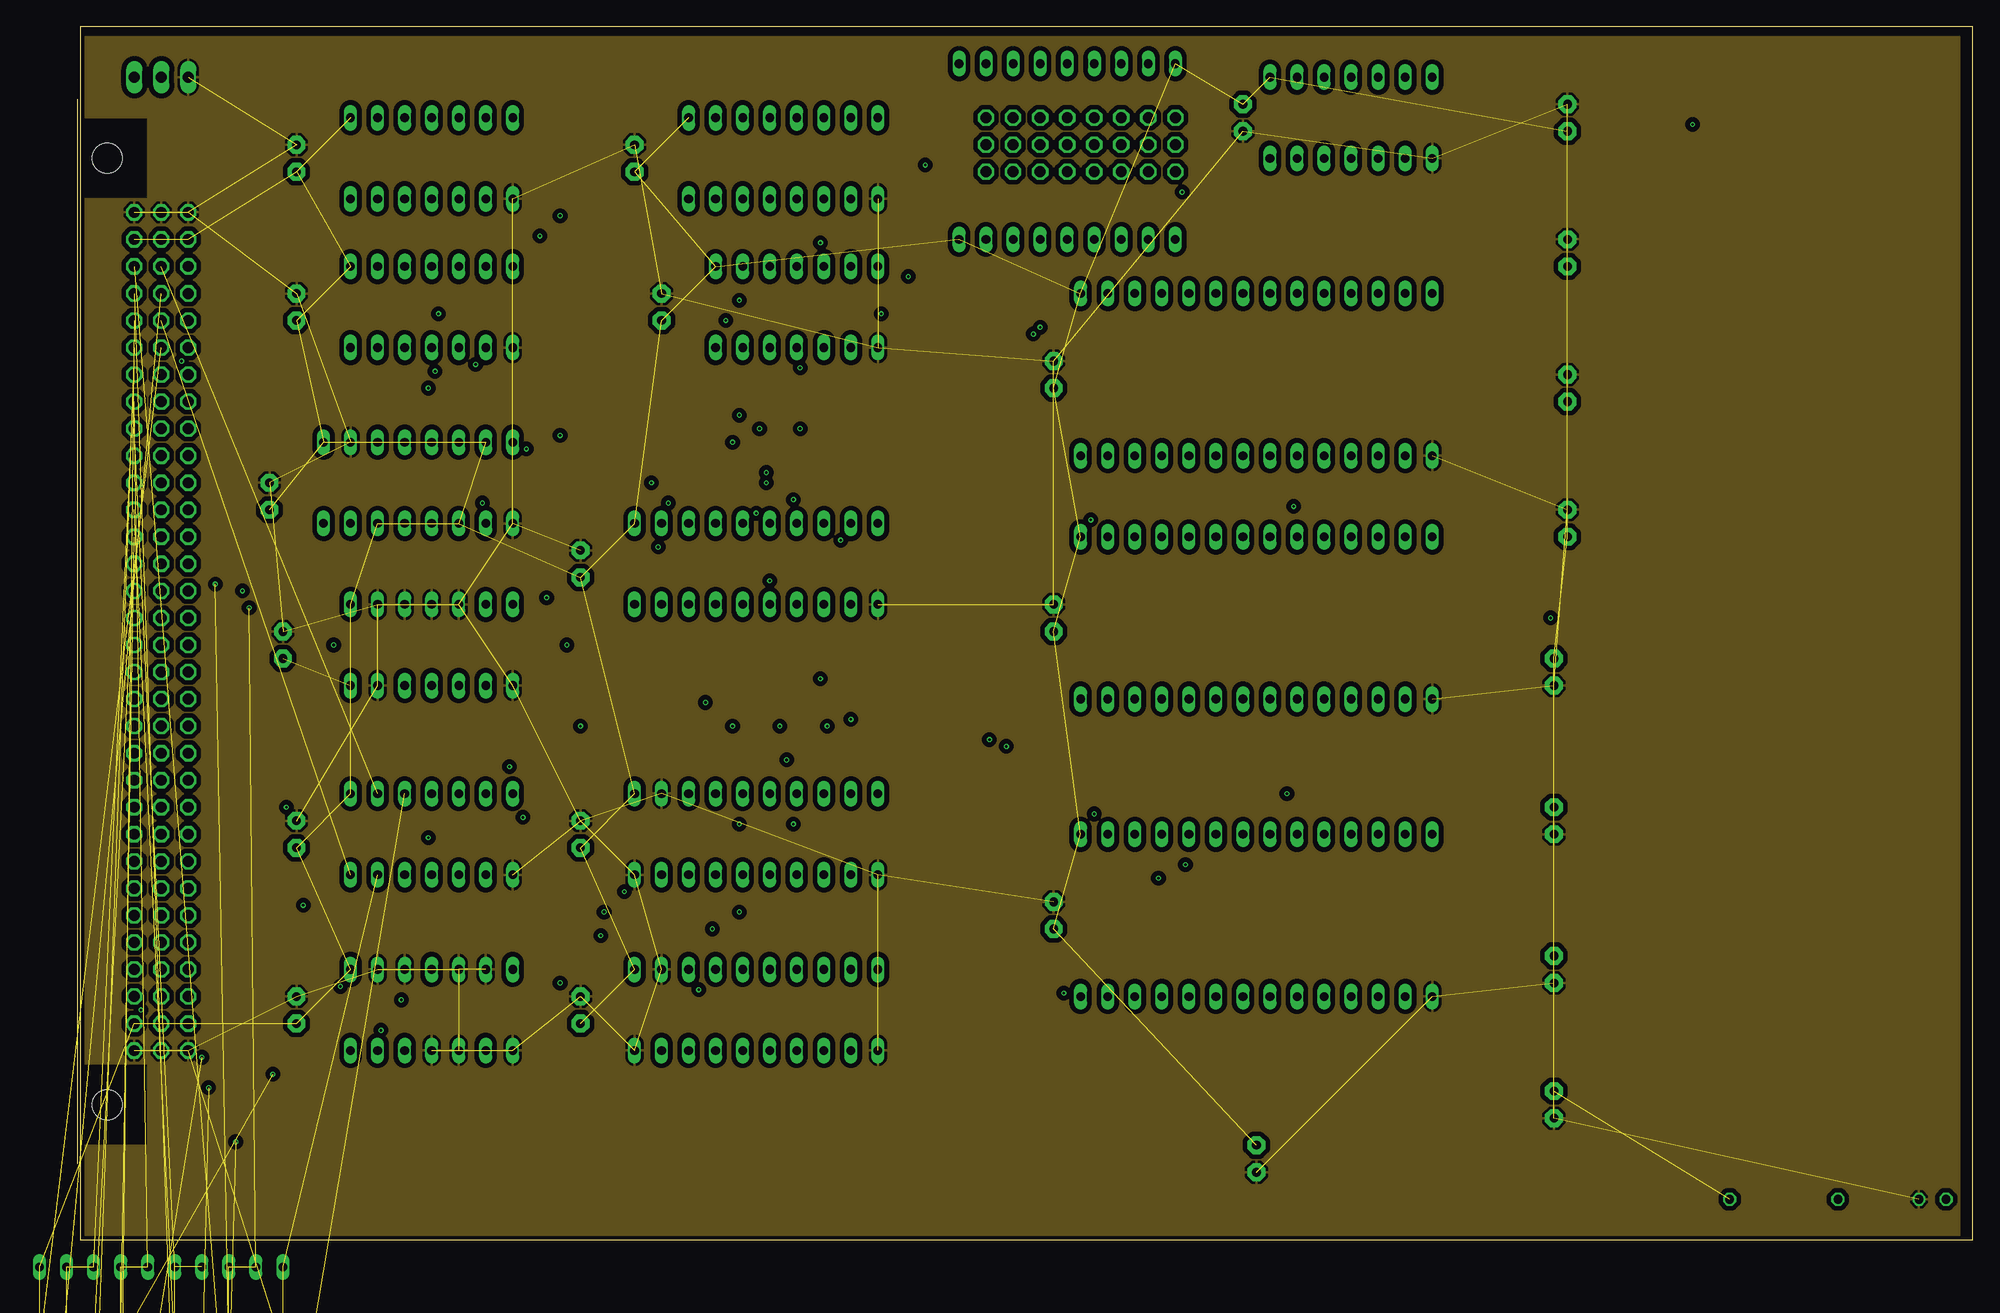
[diagram p7: board, inner layer Route2]
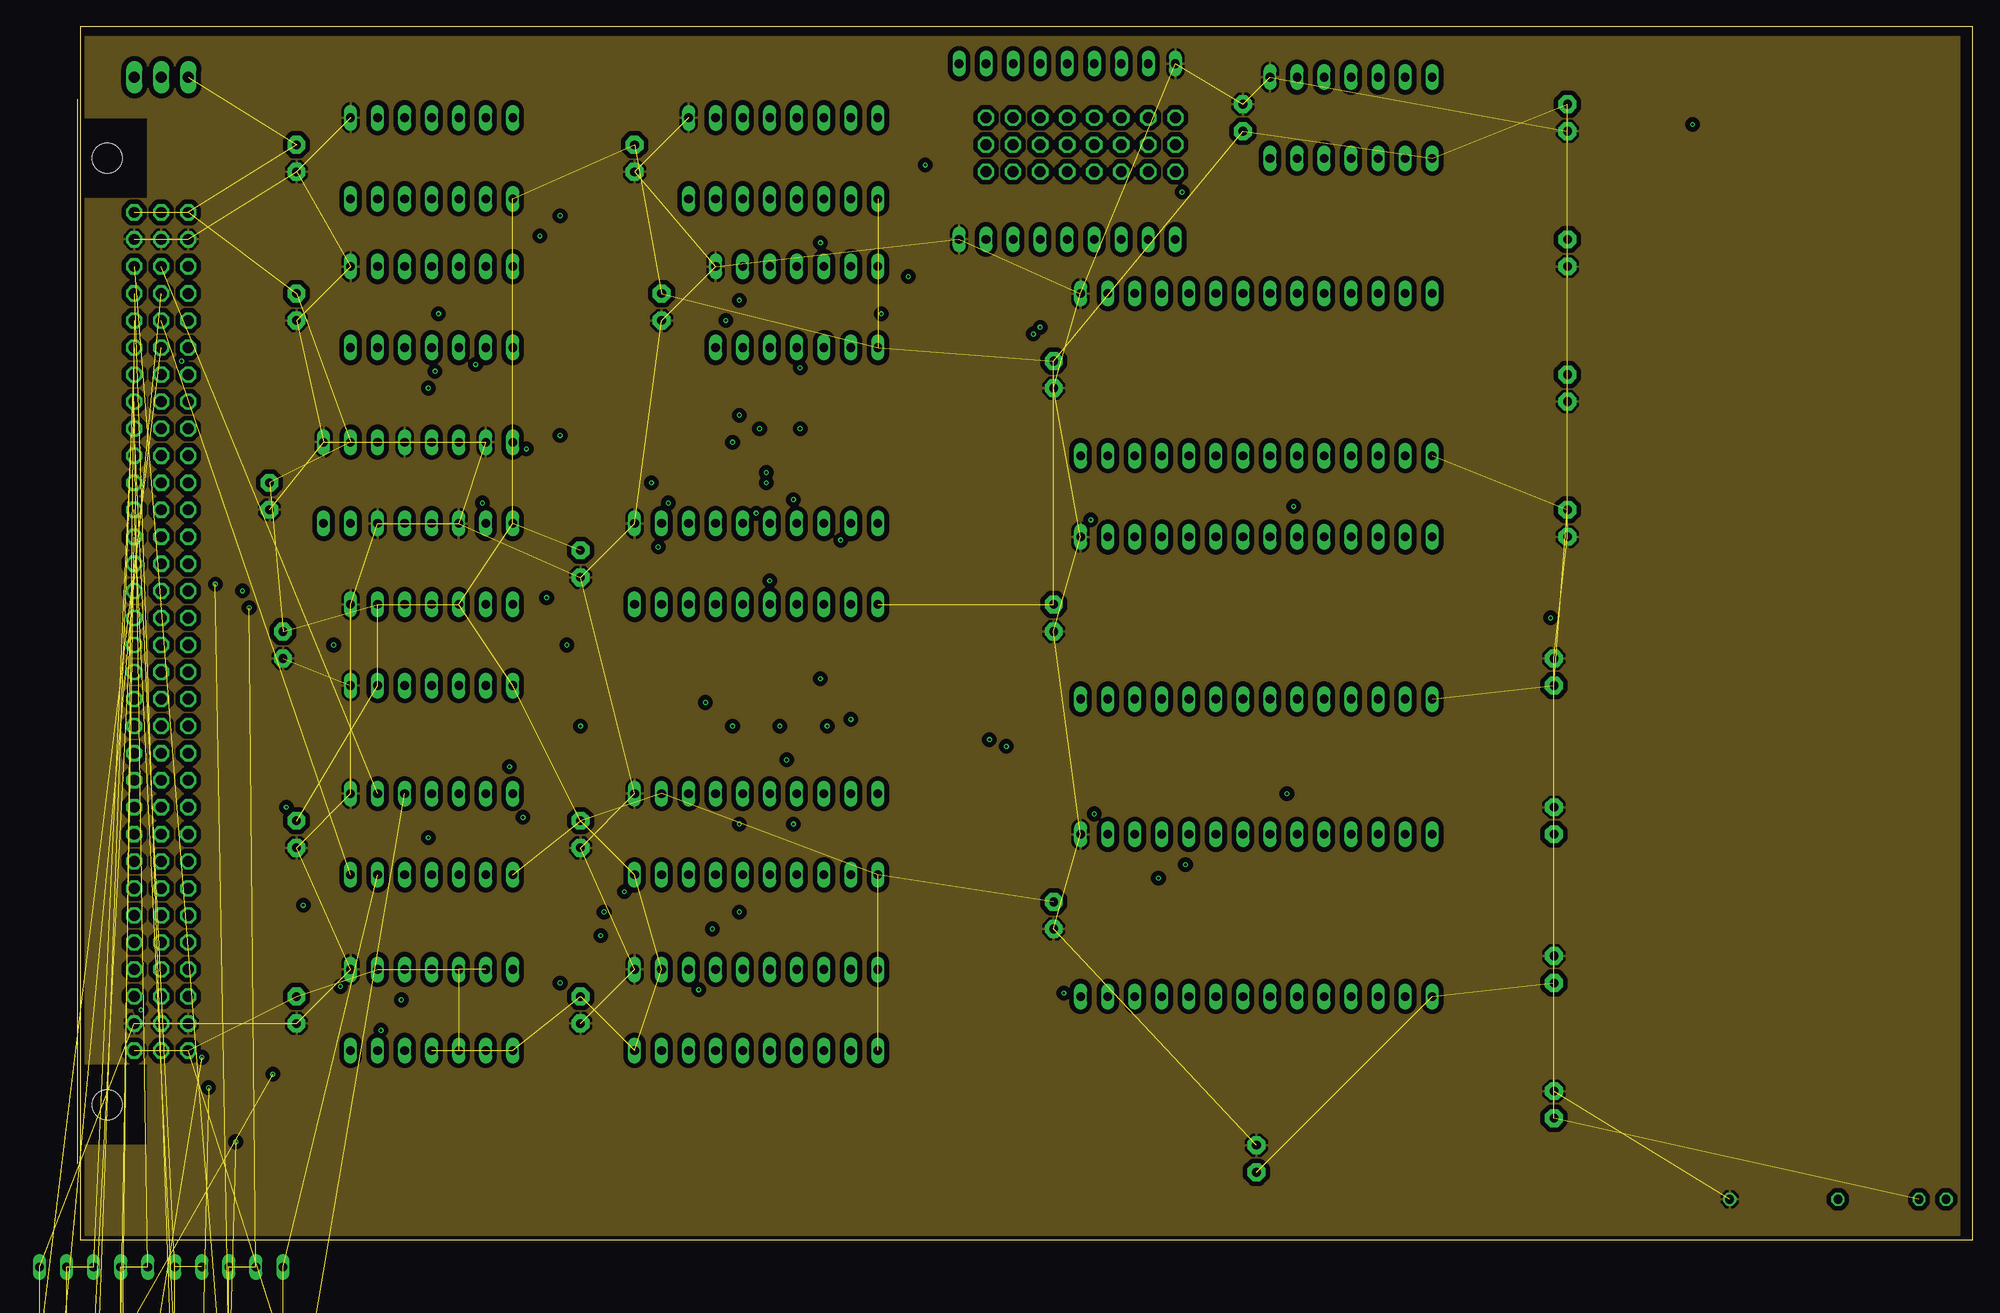
[diagram p8: board, inner layer Route15]
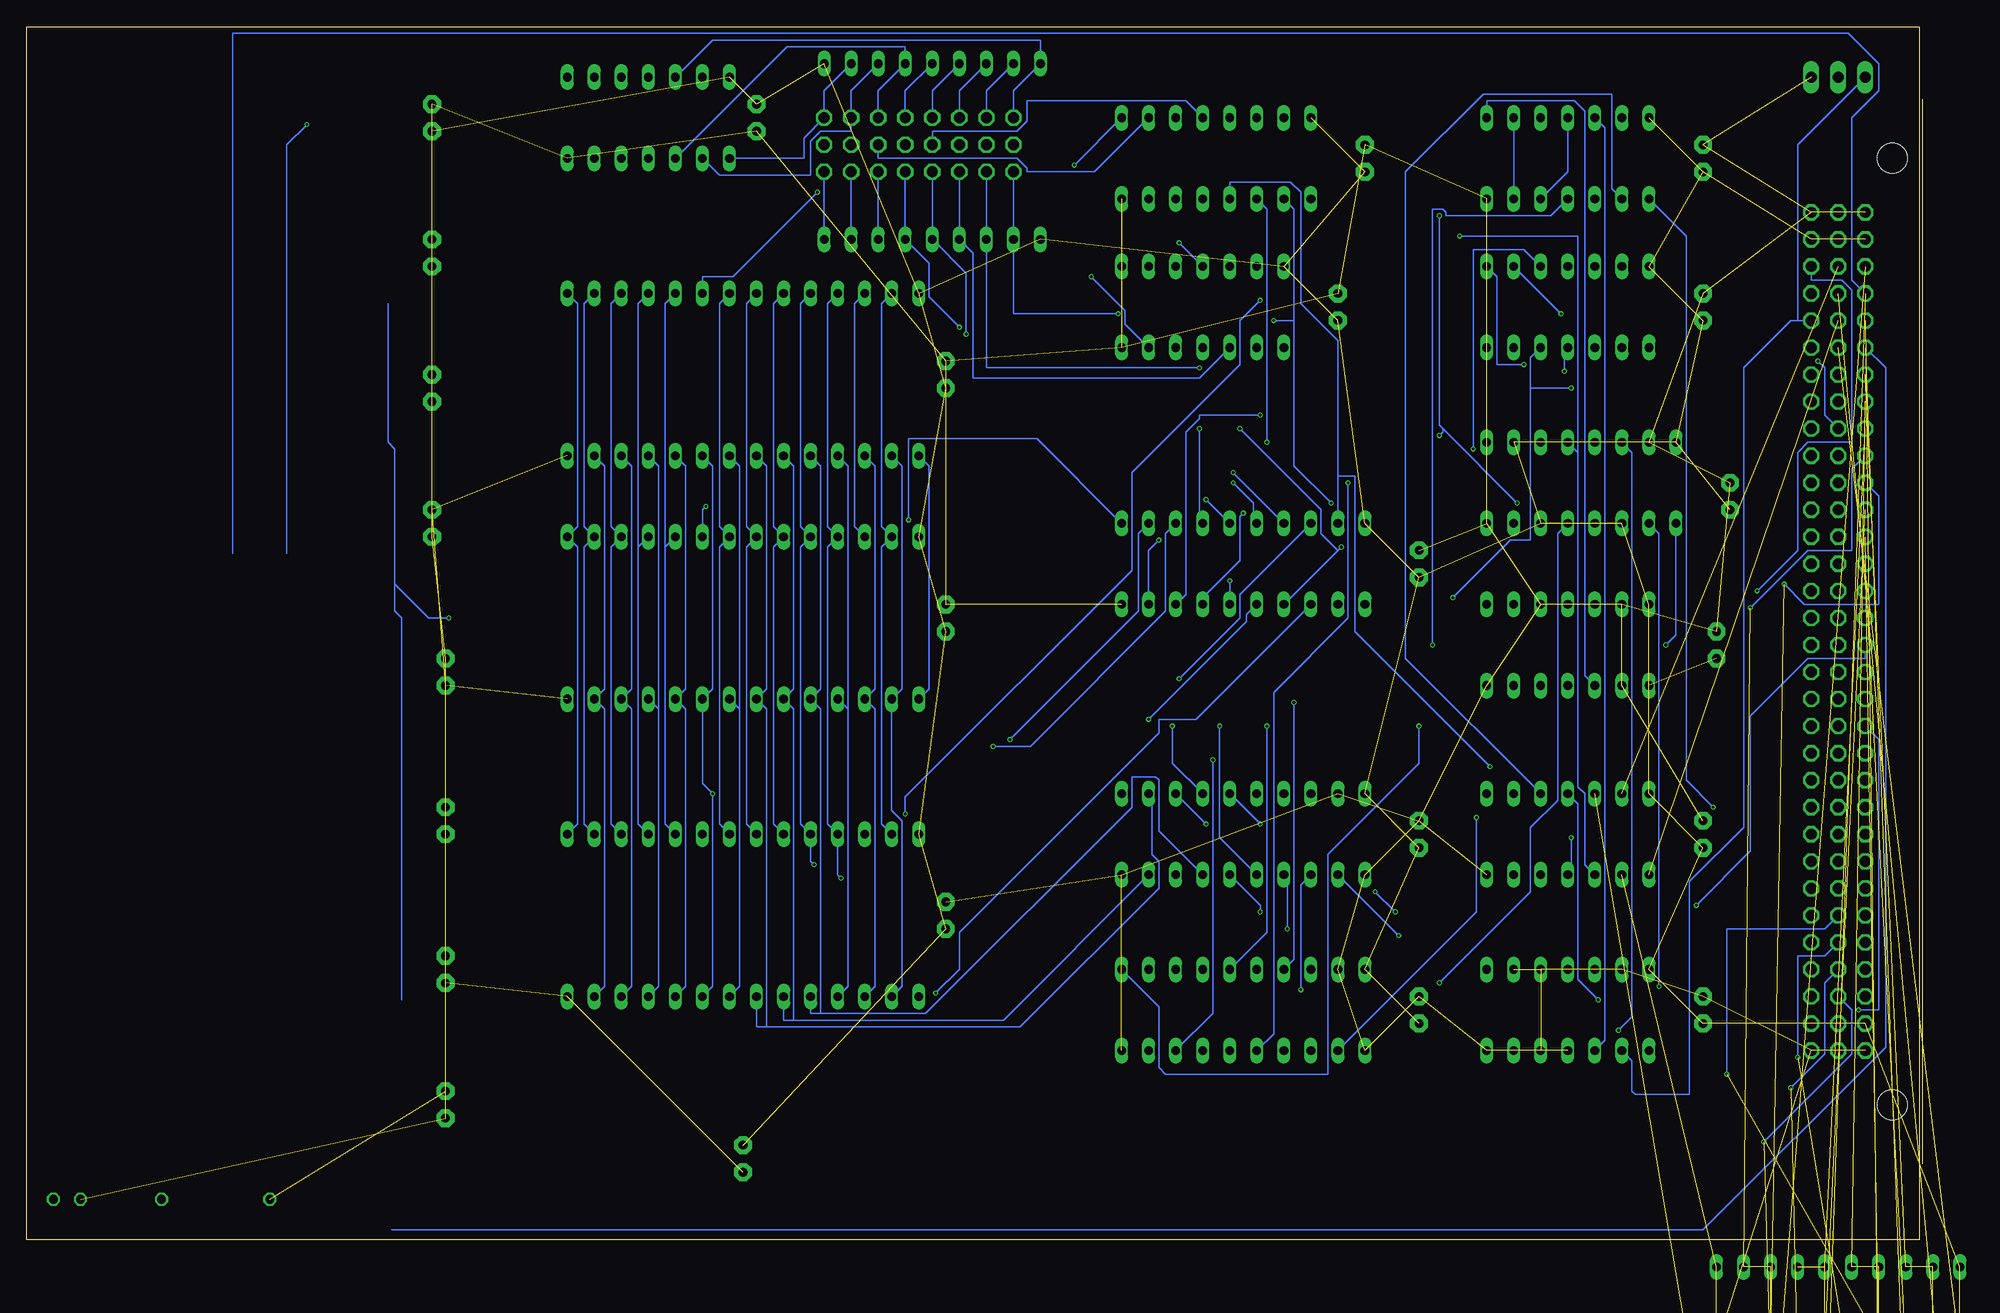
[diagram p9: board, bottom side, seen from below]

Size 177.78 x 113.97 mm. Coordinates in mm from the lower left corner, seen from the top.
Outline: 0,0 177.78,0 177.78,113.97 0,113.97 0,0
Copper layers (1*2*15*16): Top 0.035559375mm / dielectric 0.17018125mm / Route2 0.01778125mm / dielectric 47mil / Route15 0.01778125mm / dielectric 0.17018125mm / Bottom 0.035559375mm
Design rules "oshpark-4layer *": minimum track width 6mil, minimum drill 10mil, track to track 18mil, track to pad 10mil, pad to pad 5mil, via to via 5mil, smd to smd 5mil, copper to edge 15mil, drill to drill 6mil, minimum pad ring 4mil, minimum via ring 4mil, stop-mask expansion 2.5mil, vias tented up to drill 0mil, thermal gap 10mil

### Footprints (pad centres in the part's own frame; a part is rotated, then mirrored left to right if it is on the bottom)
C025-025X050 = drill 0.813 pad 1.676 octagon: 1 -1.27,0; 2 1.27,0
DIL28-6 = drill 0.813 long: 1 -16.51,-7.62; 2 -13.97,-7.62; 3 -11.43,-7.62; 4 -8.89,-7.62; 5 -6.35,-7.62; 6 -3.81,-7.62; 7 -1.27,-7.62; 8 1.27,-7.62; 9 3.81,-7.62; 10 6.35,-7.62; 11 8.89,-7.62; 12 11.43,-7.62; 13 13.97,-7.62; 14 16.51,-7.62; 15 16.51,7.62; 16 13.97,7.62; 17 11.43,7.62; 18 8.89,7.62; 19 6.35,7.62; 20 3.81,7.62; 21 1.27,7.62; 22 -1.27,7.62; 23 -3.81,7.62; 24 -6.35,7.62; 25 -8.89,7.62; 26 -11.43,7.62; 27 -13.97,7.62; 28 -16.51,7.62
DIL14 = drill 0.813 long: 1 -7.62,-3.81; 2 -5.08,-3.81; 3 -2.54,-3.81; 4 0,-3.81; 5 2.54,-3.81; 6 5.08,-3.81; 7 7.62,-3.81; 8 7.62,3.81; 9 5.08,3.81; 10 2.54,3.81; 11 0,3.81; 12 -2.54,3.81; 13 -5.08,3.81; 14 -7.62,3.81
DIL20 = drill 0.813 long: 1 -11.43,-3.81; 2 -8.89,-3.81; 3 -6.35,-3.81; 4 -3.81,-3.81; 5 -1.27,-3.81; 6 1.27,-3.81; 7 3.81,-3.81; 8 6.35,-3.81; 9 8.89,-3.81; 10 11.43,-3.81; 11 11.43,3.81; 12 8.89,3.81; 13 6.35,3.81; 14 3.81,3.81; 15 1.27,3.81; 16 -1.27,3.81; 17 -3.81,3.81; 18 -6.35,3.81; 19 -8.89,3.81; 20 -11.43,3.81
DIL16 = drill 0.813 long: 1 -8.89,-3.81; 2 -6.35,-3.81; 3 -3.81,-3.81; 4 -1.27,-3.81; 5 1.27,-3.81; 6 3.81,-3.81; 7 6.35,-3.81; 8 8.89,-3.81; 9 8.89,3.81; 10 6.35,3.81; 11 3.81,3.81; 12 1.27,3.81; 13 -1.27,3.81; 14 -3.81,3.81; 15 -6.35,3.81; 16 -8.89,3.81
1X03 = drill 1.016 long: 1 -2.54,0; 2 0,0; 3 2.54,0
LED5MM = drill 0.813 octagon: A -1.27,0; K 1.27,0
0207/10 = drill 0.813 octagon: 1 -5.08,0; 2 5.08,0
RN-9 = drill 0.813 long: 1 -10.16,0; 2 -7.62,0; 3 -5.08,0; 4 -2.54,0; 5 0,0; 6 2.54,0; 7 5.08,0; 8 7.62,0; 9 10.16,0
SIL9 = drill 0.813 long: 1 -10.16,0; 2 -7.62,0; 3 -5.08,0; 4 -2.54,0; 5 0,0; 6 2.54,0; 7 5.08,0; 8 7.62,0; 9 10.16,0
PIN_3X8 = drill 1.016 octagon: 1 1.27,-1.27; 2 3.81,-1.27; 3 6.35,-1.27; 4 8.89,-1.27; 5 11.43,-1.27; 6 13.97,-1.27; 7 16.51,-1.27; 8 19.05,-1.27; 9 1.27,-3.81; 10 3.81,-3.81; 11 6.35,-3.81; 12 8.89,-3.81; 13 11.43,-3.81; 14 13.97,-3.81; 15 16.51,-3.81; 16 19.05,-3.81; 17 1.27,-6.35; 18 3.81,-6.35; 19 6.35,-6.35; 20 8.89,-6.35; 21 11.43,-6.35; 22 13.97,-6.35; 23 16.51,-6.35; 24 19.05,-6.35
FABC96R = drill 1.016 octagon: A1 -2.54,39.37; A2 -2.54,36.83; A3 -2.54,34.29; A4 -2.54,31.75; A5 -2.54,29.21; A6 -2.54,26.67; A7 -2.54,24.13; A8 -2.54,21.59; A9 -2.54,19.05; A10 -2.54,16.51; A11 -2.54,13.97; A12 -2.54,11.43; A13 -2.54,8.89; A14 -2.54,6.35; A15 -2.54,3.81; A16 -2.54,1.27; A17 -2.54,-1.27; A18 -2.54,-3.81; A19 -2.54,-6.35; A20 -2.54,-8.89; A21 -2.54,-11.43; A22 -2.54,-13.97; A23 -2.54,-16.51; A24 -2.54,-19.05; A25 -2.54,-21.59; A26 -2.54,-24.13; A27 -2.54,-26.67; A28 -2.54,-29.21; A29 -2.54,-31.75; A30 -2.54,-34.29; A31 -2.54,-36.83; A32 -2.54,-39.37; B1 -5.08,39.37; B2 -5.08,36.83; B3 -5.08,34.29; B4 -5.08,31.75; B5 -5.08,29.21; B6 -5.08,26.67; B7 -5.08,24.13; B8 -5.08,21.59; B9 -5.08,19.05; B10 -5.08,16.51; B11 -5.08,13.97; B12 -5.08,11.43; B13 -5.08,8.89; B14 -5.08,6.35; B15 -5.08,3.81; B16 -5.08,1.27; B17 -5.08,-1.27; B18 -5.08,-3.81; B19 -5.08,-6.35; B20 -5.08,-8.89; B21 -5.08,-11.43; B22 -5.08,-13.97; B23 -5.08,-16.51; B24 -5.08,-19.05; B25 -5.08,-21.59; B26 -5.08,-24.13; B27 -5.08,-26.67; B28 -5.08,-29.21; B29 -5.08,-31.75; B30 -5.08,-34.29; B31 -5.08,-36.83; B32 -5.08,-39.37; C1 -7.62,39.37; C2 -7.62,36.83; C3 -7.62,34.29; C4 -7.62,31.75; C5 -7.62,29.21; C6 -7.62,26.67; C7 -7.62,24.13; C8 -7.62,21.59; C9 -7.62,19.05; C10 -7.62,16.51; C11 -7.62,13.97; C12 -7.62,11.43; C13 -7.62,8.89; C14 -7.62,6.35; C15 -7.62,3.81; C16 -7.62,1.27; C17 -7.62,-1.27; C18 -7.62,-3.81; C19 -7.62,-6.35; C20 -7.62,-8.89; C21 -7.62,-11.43; C22 -7.62,-13.97; C23 -7.62,-16.51; C24 -7.62,-19.05; C25 -7.62,-21.59; C26 -7.62,-24.13; C27 -7.62,-26.67; C28 -7.62,-29.21; C29 -7.62,-31.75; C30 -7.62,-34.29; C31 -7.62,-36.83; C32 -7.62,-39.37 | hole 2.794: 0,-44.456; 0,44.456

### Placement (x,y rotation side)
C1  91.44,81.28 90 top
C2  91.44,58.42 90 top
C3  91.44,30.48 90 top
C4  46.99,21.59 90 top
C5  46.99,38.1 90 top
C6  46.99,63.5 90 top
C7  54.61,87.63 90 top
C8  52.07,101.6 90 top
C9  20.32,101.6 90 top
C10  20.32,87.63 90 top
C11  17.78,69.85 90 top
C12  19.05,55.88 90 top
C13  20.32,38.1 90 top
C14  139.7,105.41 90 top
C15  139.7,92.71 90 top
C16  139.7,80.01 90 top
C17  139.7,67.31 90 top
C18  20.32,21.59 90 top
C19  138.43,53.34 90 top
C20  138.43,39.37 90 top
C21  138.43,25.4 90 top
C22  138.43,12.7 90 top
C23  110.49,7.62 90 top
C24  109.22,105.41 90 top
IC1  110.49,81.28 0 top
IC2  110.49,58.42 0 top
IC3  33.02,21.59 0 top
IC4  67.31,87.63 0 top
IC5  63.5,63.5 0 top
IC6  33.02,87.63 0 top
IC7  66.04,101.6 0 top
IC8  63.5,38.1 0 top
IC9  63.5,21.59 0 top
IC10  33.02,101.6 0 top
IC11  31.75,71.12 0 top
IC12  33.02,55.88 0 top
IC13  110.49,30.48 0 top
IC14  33.02,38.1 0 top
IC18  119.38,105.41 0 top
IC26  7.62,-6.35 0 top
IC27  7.62,-17.78 0 top  (outside the outline)
IC28  7.62,-29.21 0 top  (outside the outline)
IC29  7.62,-40.64 0 top  (outside the outline)
JP1  7.62,109.22 0 top
PWR  173.99,3.81 180 top
R2  160.02,3.81 180 top
RN5  3.81,-60.96 0 top  (outside the outline)
RN6  3.81,-66.04 0 top  (outside the outline)
RN7  92.71,110.49 180 top
RN8  92.71,93.98 0 top
U$1  83.82,106.68 0 top
X1  2.54,57.15 180 top

### Tracks (layer width: path | path; a pad name or v marks a point on that pad's centre or on a via)
-BUS-EN
  Bottom 0.152: IC3.2 26.99,16.83 26.99,13.97 26.67,13.65 21.59,13.65 21.59,33.66 16.51,38.73 16.51,81.92 12.06,86.36 11.43,86.36 | X1.C28 11.43,86.36 | JP1.1 11.43,102.87 11.43,86.36
-HI-RAM  (via drill 0.25)
  Top 0.152: v41.91,74.3 43.81,72.39 62.23,72.39 65.72,68.9 v113.98,68.9
  Bottom 0.152: IC6.10 37.15,93.03 41.91,93.03 v41.91,74.3 | v113.98,68.9 114.3,68.58 IC2.20
-LO-RAM  (via drill 0.25)
  Top 0.152: IC10.3 34.29,101.6 61.28,101.6 63.5,99.38 80.01,99.38 80.96,98.42 v103.5,98.42
  Bottom 0.152: v103.5,98.42 111.44,90.49 114.3,90.49 IC1.20
-MEM-RD  (via drill 0.25)
  Top 0.152: IC5.1 51.44,60.33 v43.81,60.33 | X1.B23 6.35,74.93 4.76,74.93 3.81,75.88 3.81,80.01 v32.7,80.01
  Bottom 0.152: v43.81,60.33 38.42,65.72 36.51,65.72 36.51,80.01 | 36.51,80.01 36.51,82.87 IC6.5 | 36.51,80.01 v32.7,80.01
-MEM-WR  (via drill 0.25)
  Top 0.152: v33.66,87 32.7,86.04 21.91,86.04 18.41,82.55 v9.53,82.55
  Bottom 0.152: v33.66,87 IC6.9 | v9.53,82.55 8.89,81.92 8.89,77.47 X1.B24
-RESET  (via drill 0.25)
  Top 0.152: IC12.4 29.84,55.24 22.86,55.24 19.37,58.74 15.56,58.74 15.24,59.05 v15.24,60.96
  Bottom 0.152: v15.24,60.96 11.43,64.77 11.43,73.98 10.48,74.93 6.35,74.93 6.35,89.22 7.3,90.17 10.16,90.17 X1.C30
-ROM-CS  (via drill 0.25)
  Top 0.152: IC6.12 32.07,89.85 53.66,89.85 53.98,90.17 58.74,90.17 60.64,88.27 v61.91,88.27 | v95.25,40.01 95.57,39.69 112.71,39.69 IC13.20
  Bottom 0.152: v61.91,88.27 63.82,86.36 63.82,82.23 73.98,72.07 73.98,62.87 95.25,41.59 v95.25,40.01
-TMP-REG-LD0  (1 unrouted)
-TMP-REG-LD1  (1 unrouted)
-TMP-REG-RD0  (2 unrouted)
-TMP-REG-RD1  (2 unrouted)
-VMA  (via drill 0.25)
  Top 0.152: v30.16,22.54 IC3.1 | X1.C12 12.06,43.81 31.11,43.81 31.43,43.5 | IC14.11 31.43,43.5 | v40.32,44.45 39.37,43.5 31.43,43.5
  Bottom 0.152: 54.61,71.75 54.61,84.45 58.1,87.95 58.1,98.42 59.05,99.38 64.77,99.38 IC7.4 | 54.61,71.75 IC5.19 | v30.16,22.54 32.07,24.45 32.07,40.96 IC14.11 | 54.61,71.75 53.02,71.75 53.02,57.15 v40.32,44.45
ADDR0  (via drill 0.25)
  Top 0.152: v48.9,28.57 47.31,26.99 13.34,26.99 10.48,24.13 6.35,24.13 X1.A3
  Bottom 0.152: v48.9,28.57 IC8.2
ADDR1  (via drill 0.25)
  Top 0.152: v59.37,29.21 13.02,29.21 10.48,26.67 6.35,26.67 X1.A4
  Bottom 0.152: IC8.4 59.37,33.97 v59.37,29.21
ADDR2  (via drill 0.25)
  Top 0.152: v61.91,30.8 60.96,29.84 11.11,29.84 10.48,29.21 6.35,29.21 X1.A5
  Bottom 0.152: IC8.6 61.91,31.43 v61.91,30.8
ADDR3  (via drill 0.25)
  Top 0.152: IC8.8 68.26,32.7 v51.12,32.7 | v49.21,30.8 11.43,30.8 10.48,31.75 6.35,31.75 X1.A6
  Bottom 0.152: v49.21,30.8 v51.12,32.7
ADDR4
  Top 0.152: IC8.11 72.39,44.45 41.27,44.45 39.37,46.35 11.11,46.35 10.48,46.99 4.76,46.99 3.17,45.4 3.17,33.02 X1.A7
ADDR5  (via drill 0.25)
  Top 0.152: v66.99,39.05 63.82,35.88 47.94,35.88 47.62,35.56 41.59,35.56 41.27,35.88 21.27,35.88 19.68,34.29 6.35,34.29 X1.A8
  Bottom 0.152: v66.99,39.05 IC8.13
ADDR6  (via drill 0.25)
  Top 0.152: v61.91,39.05 60.96,38.1 33.97,38.1 33.02,37.15 21.91,37.15 20.95,38.1 11.75,38.1 10.48,39.37 6.35,39.37 X1.A9
  Bottom 0.152: v61.91,39.05 IC8.15
ADDR7
  Top 0.152: IC8.17 58.1,43.5 46.35,43.5 41.91,39.05 23.5,39.05 20.64,41.91 6.35,41.91 X1.A10
ADDR8  (via drill 0.25)
  Top 0.152: v41.59,39.69 40.96,40.32 23.81,40.32 20.95,43.18 11.75,43.18 10.48,44.45 6.35,44.45 X1.A11
  Bottom 0.152: IC9.2 41.59,30.8 v41.59,39.69
ADDR9
  Top 0.152: IC9.4 58.1,16.19 13.34,16.19 10.48,19.05 4.76,19.05 3.81,20 3.81,31.75 5.4,31.75 6.35,32.7 6.35,33.66 6.03,33.66 5.4,34.29 4.76,34.29 3.81,35.24 3.81,45.09 4.45,45.09 X1.A12
ADDR10  (via drill 0.25)
  Top 0.152: IC9.6 62.55,20 49.21,20 47.62,21.59 32.07,21.59 30.48,23.18 22.54,23.18 20.95,21.59 v5.71,21.59
  Bottom 0.152: v5.71,21.59 3.81,21.59 3.81,46.99 X1.A13
ADDR11  (via drill 0.25)
  Top 0.152: v66.36,45.09 64.45,46.99 13.02,46.99 10.48,49.53 6.35,49.53 X1.A14
  Bottom 0.152: IC9.8 66.36,21.27 v66.36,45.09
ADDR12  (via drill 0.25)
  Top 0.152: v46.99,48.26 14.29,48.26 10.48,52.07 6.35,52.07 X1.A15
  Bottom 0.152: IC9.11 71.44,21.91 71.44,16.19 70.8,15.56 55.56,15.56 55.56,36.2 46.99,44.77 v46.99,48.26
ADDR13  (via drill 0.25)
  Top 0.152: IC9.13 63.82,31.43 v20.95,31.43
  Bottom 0.152: v20.95,31.43 15.88,36.51 15.88,49.21 10.48,54.61 5.08,54.61 X1.A16
ADDR14  (via drill 0.25)
  Top 0.152: v61.28,48.26 60.64,48.9 18.73,48.9 10.48,57.15 6.35,57.15 X1.A17
  Bottom 0.152: IC9.15 61.28,28.89 v61.28,48.26
ADDR15  (via drill 0.25)
  Top 0.152: 45.72,50.48 19.68,50.48 10.48,59.69 6.35,59.69 X1.A18 | 45.72,50.48 v58.74,50.48 | 45.72,50.48 v45.72,55.88
  Bottom 0.152: IC9.17 58.74,26.35 v58.74,50.48 | IC10.4 34.61,96.2 44.45,96.2 44.45,96.52 44.77,96.84 45.72,96.84 v45.72,55.88
BADDR0
  Top 0.152: IC8.18 59.37,39.69 93.98,39.69 94.93,40.64 113.98,40.64 115.89,38.73 115.89,22.86 IC13.10
  Bottom 0.152: IC1.10 115.89,72.71 115.89,51.75 IC2.10 115.89,49.85 115.89,23.81 IC13.10
BADDR1  (via drill 0.25)
  Top 0.152: IC8.16 63.82,40.32 93.66,40.32 95.25,41.91 v113.35,41.91
  Bottom 0.152: IC13.9 113.35,23.81 v113.35,41.91 114.3,42.86 IC2.9 113.35,51.75 113.35,72.71 IC1.9
BADDR2  (via drill 0.25)
  Top 0.152: v70.17,48.26 71.44,49.53 92.08,49.53 93.03,48.58 109.54,48.58 IC2.8
  Bottom 0.152: IC8.14 70.17,44.77 v70.17,48.26 | IC13.8 110.81,23.81 110.81,49.85 | IC2.8 110.81,49.85 | IC1.8 110.81,72.71 110.81,49.85
BADDR3
  Bottom 0.152: IC1.7 108.27,72.71 108.27,51.75 IC2.7 108.27,49.85 108.27,20 | IC8.12 72.07,41.59 72.07,36.2 71.44,35.56 71.44,33.02 84.45,20 108.27,20 | 108.27,20 109.22,20 IC13.7
BADDR4
  Bottom 0.152: IC1.6 105.73,72.71 105.73,51.75 IC2.6 105.73,49.85 105.73,20.64 | IC8.9 86.04,20.64 105.73,20.64 | 105.73,20.64 106.68,20.64 IC13.6
BADDR5
  Bottom 0.152: IC1.5 103.19,72.71 103.19,51.75 IC2.5 103.19,49.85 103.19,21.27 | IC8.7 71.44,38.42 71.44,43.18 71.75,43.5 73.98,43.5 73.98,40.64 93.34,21.27 103.19,21.27 | 103.19,21.27 104.14,21.27 IC13.5
BADDR6  (via drill 0.25)
  Top 0.152: v65.72,48.26 67.63,50.16 92.39,50.16 93.34,49.21 100.01,49.21 IC2.4
  Bottom 0.152: IC8.5 65.72,37.78 v65.72,48.26 | IC13.4 100.65,23.81 100.65,49.85 | IC2.4 100.65,49.85 | IC1.4 100.65,72.71 100.65,49.85
BADDR7  (via drill 0.25)
  Top 0.152: v58.1,23.5 59.69,21.91 90.17,21.91 92.71,24.45 97.47,24.45 IC13.3
  Bottom 0.152: IC1.3 98.11,72.71 98.11,51.75 IC2.3 98.11,49.85 98.11,23.81 IC13.3 | IC8.3 58.1,33.34 v58.1,23.5
BADDR8  (via drill 0.25)
  Top 0.152: IC9.18 60.01,22.54 89.85,22.54 v101.28,33.97
  Bottom 0.152: IC1.25 102.55,87.95 102.55,66.99 IC2.25 102.55,65.09 102.55,39.05 IC13.25 101.6,34.29 v101.28,33.97
BADDR9  (via drill 0.25)
  Top 0.152: IC9.16 64.45,23.18 89.53,23.18 101.6,35.24 v103.82,35.24
  Bottom 0.152: IC1.24 105.09,87.95 105.09,66.99 IC2.24 105.09,65.09 105.09,39.05 IC13.24 104.14,35.56 v103.82,35.24
BADDR10
  Top 0.152: IC9.14 68.9,23.81 76.2,23.81 88.27,35.88 109.54,35.88 IC13.21
  Bottom 0.152: IC1.21 112.71,87.95 112.71,66.99 IC2.21 112.71,65.09 112.71,39.05 IC13.21
BADDR11
  Top 0.152: IC9.12 83.5,36.51 105.09,36.51 IC13.23
  Bottom 0.152: IC1.23 107.63,87.95 107.63,66.99 IC2.23 107.63,65.09 107.63,39.05 IC13.23
BADDR12  (via drill 0.25)
  Top 0.152: IC11.4 32.38,69.22 v37.78,69.22 | v45.09,96.2 46.67,97.79 IC7.1 | IC1.2 94.61,75.56 v45.09,75.56
  Bottom 0.152: IC13.2 95.57,23.81 95.57,39.37 96.52,40.32 IC2.2 95.57,51.75 95.57,72.71 IC1.2 | 44.77,76.2 45.09,76.52 v45.09,96.2 | 44.77,76.2 v37.78,69.22 | v45.09,75.56 44.77,75.88 44.77,76.2
BADDR13  (via drill 0.25)
  Top 0.152: IC11.7 40.01,69.22 v55.24,69.22 | IC1.26 96.52,86.36 v60.64,86.36
  Bottom 0.152: IC2.26 100.01,66.99 100.01,87.95 IC1.26 | v55.24,69.22 58.74,72.71 58.74,86.36 | 58.74,86.36 58.74,96.84 IC7.2 | 58.74,86.36 v60.64,86.36
BADDR14  (via drill 0.25)
  Top 0.152: IC11.9 v61.28,74.93 92.71,74.93 IC1.1
  Bottom 0.152: IC2.1 93.03,51.75 93.03,72.71 IC1.1 | IC7.3 61.28,96.84 v61.28,74.93
BADDR15  (via drill 0.25)
  Top 0.152: IC7.6 66.36,94.3 v43.18,94.3
  Bottom 0.152: IC14.3 31.43,35.24 31.43,41.91 32.07,42.55 32.07,73.98 | IC11.12 32.07,73.98 | v43.18,94.3 32.07,94.3 32.07,73.98
BDATA0  (via drill 0.25)
  Top 0.152: v69.53,52.7 69.85,52.39 117.79,52.39 IC2.11
  Bottom 0.152: IC13.11 118.43,23.81 118.43,49.85 | IC2.11 118.43,49.85 | IC5.18 63.82,60.64 63.82,58.42 v69.53,52.7 | IC1.11 118.43,72.71 118.43,49.85
BDATA1  (via drill 0.25)
  Top 0.152: v64.45,72.07 120.33,72.07 IC1.12
  Bottom 0.152: IC13.12 120.97,23.81 120.97,49.85 IC2.12 120.97,51.75 120.97,72.71 IC1.12 | v64.45,72.07 IC5.17
BDATA2  (via drill 0.25)
  Top 0.152: v64.45,71.12 64.77,71.44 122.24,71.44 IC1.13
  Bottom 0.152: IC13.13 123.51,23.81 123.51,49.85 IC2.13 123.51,51.75 123.51,72.71 IC1.13 | IC5.16 62.55,67.63 62.55,69.22 v64.45,71.12
BDATA3  (via drill 0.25)
  Top 0.152: v66.99,69.53 68.26,70.8 123.83,70.8 126.05,73.03 126.05,88.9 IC1.15
  Bottom 0.152: IC13.15 126.05,39.05 126.05,65.09 IC2.15 126.05,66.99 126.05,87.95 IC1.15 | v66.99,69.53 IC5.15
BDATA4  (via drill 0.25)
  Top 0.152: v67.63,76.2 70.17,78.74 114.3,78.74 IC1.16
  Bottom 0.152: IC13.16 125.41,39.05 125.41,65.09 IC2.16 125.41,66.99 125.41,87.95 IC1.16 | IC5.14 67.63,67.63 v67.63,76.2
BDATA5  (via drill 0.25)
  Top 0.152: v87,46.35 90.17,43.18 116.84,43.18 IC13.17
  Bottom 0.152: IC1.17 122.87,87.95 122.87,66.99 IC2.17 122.87,65.09 122.87,39.05 IC13.17 | IC5.13 70.8,66.36 70.8,59.05 83.5,46.35 v87,46.35
BDATA6  (via drill 0.25)
  Top 0.152: v85.41,46.99 89.85,42.55 114.94,42.55 IC13.18
  Bottom 0.152: IC13.18 120.33,39.05 120.33,65.09 | IC2.18 120.33,65.09 | IC5.12 73.34,66.36 73.34,59.05 v85.41,46.99 | IC1.18 120.33,87.95 120.33,65.09
BDATA7  (via drill 0.25)
  Top 0.152: v94.93,67.63 115.25,67.63 IC2.19
  Bottom 0.152: IC5.11 82.87,75.25 94.93,75.25 v94.93,67.63 | IC13.19 117.79,39.05 117.79,65.09 | IC2.19 117.79,65.09 | IC1.19 117.79,87.95 117.79,65.09
DATA0  (via drill 0.25)  (5 unrouted)
  Top 0.152: X1.A19 6.35,62.23 18.73,62.23 22.86,58.1 53.02,58.1 IC5.2 56.2,58.1 57.78,58.1 58.74,59.05 58.74,61.28 67.94,61.28 68.9,60.33 68.9,58.1 90.49,58.1 90.81,58.42 v138.11,58.42
  Bottom 0.152: 142.56,22.54 142.56,48.58 142.56,58.42 143.19,59.05 143.19,61.59 | 143.83,87.95 143.83,74.93 143.19,74.3 143.19,61.59 | v138.11,58.42 140.02,58.42 143.19,61.59
DATA1  (via drill 0.25)  (5 unrouted)
  Top 0.152: IC5.3 53.66,63.18 47.94,63.18 47.62,63.5 11.75,63.5 10.48,64.77 6.35,64.77 X1.A20 | v92.39,23.18 92.39,20 147,20
  Bottom 0.152: IC5.3 67.94,48.9 71.44,48.9 71.44,47.62 90.17,28.89 90.17,25.4 v92.39,23.18
DATA2  (via drill 0.25)  (5 unrouted)
  Top 0.152: v54.29,65.09 53.66,65.72 47.94,65.72 47.62,66.04 41.59,66.04 40.64,65.09 12.7,65.09 10.48,67.31 6.35,67.31 X1.A21 | v63.82,76.2 67.63,80.01 89.53,80.01 90.81,81.28 113.98,81.28 120.97,88.27 120.97,90.49 138.43,90.49 141.6,87.31 153.35,87.31
  Bottom 0.152: v54.29,65.09 54.61,64.77 | 54.61,64.77 IC5.4 | 54.61,64.77 56.2,66.36 56.2,68.58 v63.82,76.2
DATA3  (via drill 0.25)  (5 unrouted)
  Top 0.152: IC5.5 60.01,57.47 22.54,57.47 18.41,61.59 v12.7,61.59 | v72.39,48.9 73.03,48.26 92.39,48.26 92.71,47.94 157.16,47.94
  Bottom 0.152: v12.7,61.59 10.79,59.69 3.81,59.69 3.81,69.85 X1.A22 | IC5.5 63.18,58.74 63.18,58.1 v72.39,48.9
DATA4  (via drill 0.25)  (5 unrouted)
  Top 0.152: IC5.6 61.91,56.83 22.23,56.83 19.68,59.37 v15.88,59.37 | v64.77,61.91 67.31,64.45 140.97,64.45 141.6,65.09 158.12,65.09 159.07,64.14 159.07,57.15
  Bottom 0.152: v15.88,59.37 10.48,64.77 6.35,64.77 6.35,72.39 X1.A23 | v64.77,61.91 IC5.6
DATA5  (via drill 0.25)  (5 unrouted)
  Top 0.152: IC5.7 67.31,55.88 140.02,55.88 140.34,55.56 152.08,55.56 | X1.A24 5.71,75.56 6.67,75.56 7.3,74.93 20.64,74.93 25.08,70.48 61.28,70.48 v63.5,68.26
  Bottom 0.152: v63.5,68.26 63.82,67.94 63.82,63.82 67.31,60.33 IC5.7
DATA6  (via drill 0.25)  (5 unrouted)
  Top 0.152: IC5.8 72.07,61.91 143.83,61.91 | X1.A25 6.35,77.47 v61.91,77.47
  Bottom 0.152: v61.91,77.47 67.63,77.47 67.63,77.15 68.9,75.88 68.9,60.64 IC5.8
DATA7  (via drill 0.25)  (5 unrouted)
  Top 0.152: IC5.9 73.98,61.28 139.38,61.28 | X1.A26 4.45,80.64 3.49,80.64 3.17,80.33 3.17,72.39 19.05,72.39 21.59,69.85 59.37,69.85 61.28,67.94 61.28,65.72 v71.44,65.72
  Bottom 0.152: v71.44,65.72 72.39,64.77 IC5.9
DATA8  (5 unrouted)
  Bottom 0.152: X1.A27 3.17,81.92 3.17,18.1 20.32,0.95 143.51,0.95
DATA9  (via drill 0.25)  (5 unrouted)
  Top 0.152: X1.A28 0.64,90.81 0.64,113.35 135.89,113.35 144.46,104.78 v151.45,104.78
  Bottom 0.152: v151.45,104.78 153.35,102.87 153.35,77.15 153.35,64.45
DATA10  (5 unrouted)
  Bottom 0.152: X1.A29 6.35,90.17 6.35,105.41 3.81,107.95 3.81,110.49 6.67,113.35 158.43,113.35 158.43,77.15 158.43,64.45
DATA11  (5 unrouted)
  Top 0.152: X1.A30 6.35,92.71 6.35,112.71 128.27,112.71 143.83,97.16 143.83,90.49 165.74,90.49 166.69,89.53 166.69,77.79 164.15,77.79
DATA12  (via drill 0.25)  (5 unrouted)
  Top 0.152: v14.61,9.21 21.59,2.22 151.76,2.22 157.8,8.26 157.8,16.51
  Bottom 0.152: X1.B3 6.35,21.59 6.35,17.46 v14.61,9.21
DATA13  (via drill 0.25)  (5 unrouted)
  Top 0.152: v12.06,14.29 18.73,7.62 129.22,7.62 130.81,6.03 150.5,6.03 152.72,8.26 152.72,16.51
  Bottom 0.152: X1.B4 8.89,24.13 8.89,17.46 v12.06,14.29
DATA14  (via drill 0.25)  (5 unrouted)
  Top 0.152: v11.43,17.14 18.41,10.16 112.08,10.16 112.39,9.84 139.7,9.84 144.78,14.92 147,14.92
  Bottom 0.152: X1.B5 8.89,26.67 11.43,26.67 v11.43,17.14
DATA15  (via drill 0.25)  (5 unrouted)
  Top 0.152: v18.1,15.56 18.41,15.24 140.02,15.24 140.34,14.92 141.92,14.92
  Bottom 0.152: X1.B6 8.89,29.21 18.1,29.21 v18.1,15.56
FORCE-ROM  (via drill 0.25)
  Top 0.152: IC12.5 31.75,55.88 v23.81,55.88
  Bottom 0.152: v23.81,55.88 22.86,56.83 IC11.1
GND  (68 unrouted)
  pour Route2: 0,113.03 176.53,113.03 176.53,0 0,0 0,8.89 6.35,8.89 6.35,16.51 0,16.51 0,97.79 6.35,97.79 6.35,105.41 0,105.41
MEM-RD
  Top 0.152: IC6.1 26.99,85.41 36.51,85.41 IC6.6
N$1
  Top 0.152: IC6.13 31.75,87.63 93.03,87.63 93.34,87.31 94.61,87.31 95.57,88.27 95.57,91.12 116.2,91.12 126.05,100.97 126.05,109.22 IC18.8
N$2  (via drill 0.25)
  Top 0.152: IC6.3 32.07,82.23 v37.15,82.23
  Bottom 0.152: v37.15,82.23 39.69,82.23 39.69,90.49 IC6.8
N$3
  Top 0.152: IC6.2 31.11,80.64 87.63,80.64 92.08,85.09 105.41,85.09 IC1.22
  Bottom 0.152: IC13.22 110.17,39.05 110.17,65.09 IC2.22 110.17,66.99 110.17,87.95 IC1.22
N$4  (via drill 0.25)
  Top 0.152: v33.34,81.6 33.66,81.28 87.31,81.28 91.76,85.72 98.11,85.72 100.01,87.63 100.01,90.49 98.11,90.49 IC1.27
  Bottom 0.152: IC13.27 97.47,39.05 97.47,65.09 IC2.27 97.47,66.99 97.47,87.95 IC1.27 | IC6.4 33.34,83.5 v33.34,81.6
N$5  (via drill 0.25)
  Top 0.152: IC4.1 59.69,87 v75.25,87
  Bottom 0.152: v75.25,87 85.09,87 RN8.2 U$1.17
N$6  (via drill 0.25)
  Top 0.152: IC4.2 64.14,81.92 v67.63,81.92
  Bottom 0.152: v67.63,81.92 87.63,81.92 RN8.3 U$1.18
N$7
  Bottom 0.152: IC4.3 67.63,80.96 88.9,80.96 88.9,92.71 RN8.4 U$1.19
N$8  (via drill 0.25)
  Top 0.152: IC4.4 68.9,82.23 86.68,82.23 v89.53,85.09
  Bottom 0.152: v89.53,85.09 89.53,90.81 RN8.5 U$1.20
N$9  (via drill 0.25)
  Top 0.152: IC4.5 71.75,85.72 v90.17,85.72
  Bottom 0.152: v90.17,85.72 93.03,88.58 93.03,91.76 RN8.6 U$1.21
N$10  (via drill 0.25)
  Top 0.152: v77.79,90.49 79.69,92.39 96.2,92.39 RN8.7
  Bottom 0.152: IC4.6 74.61,86.04 74.61,87.31 v77.79,90.49 | RN8.7 U$1.22
N$11
  Top 0.152: R2.1 166.05,4.76 174.31,4.76 PWR.A
N$12
  Bottom 0.152: IC14.10 48.26,54.61 48.26,100.33 40.96,107.63 28.89,107.63 28.89,98.74 IC10.2
N$13  (via drill 0.25)
  Top 0.152: v32.7,37.78 32.07,38.42 23.18,38.42 20.95,40.64 v19.37,40.64
  Bottom 0.152: IC14.4 32.7,34.61 v32.7,37.78 | v19.37,40.64 21.91,43.18 21.91,94.3 IC10.1
N$14
  Top 0.152: IC6.11 34.61,93.03 73.34,93.03 IC4.8
N$15  (via drill 0.25)
  Top 0.152: IC9.9 68.9,21.27 51.44,21.27 47.94,24.77 42.23,24.77 41.27,23.81 v24.45,23.81
  Bottom 0.152: v24.45,23.81 24.45,66.36 IC11.2
N$16  (via drill 0.25)
  Top 0.152: IC9.7 64.45,20.64 51.12,20.64 47.62,24.13 v45.09,24.13
  Bottom 0.152: v45.09,24.13 36.51,32.7 36.51,38.73 33.97,41.27 33.97,66.36 IC11.5
N$17  (via drill 0.25)
  Top 0.152: v53.66,71.12 53.02,71.75 38.73,71.75 IC11.11
  Bottom 0.152: IC9.5 60.64,19.37 60.64,51.44 53.66,58.42 v53.66,71.12
N$18  (via drill 0.25)
  Top 0.152: IC9.3 55.56,19.37 47.94,19.37 47.62,19.05 41.59,19.05 40.96,19.68 v28.26,19.68
  Bottom 0.152: v28.26,19.68 26.99,20.95 26.99,73.98 IC11.14
N$19
  Bottom 0.152: IC12.3 31.43,53.02 31.43,106.05 32.38,107 40.64,107 IC10.8
N$20
  Top 0.152: IC10.9 IC10.10
  Bottom 0.152: IC10.9 IC10.6
N$22
  Bottom 0.152: IC10.5 33.02,100.33 IC10.11
N$24
  Top 0.152: IC7.5 65.09,95.57 21.27,95.57 JP1.2
N$25
  Top 0.152: IC10.12 IC10.13
  Bottom 0.152: IC3.3 29.53,18.73 29.53,104.46 IC10.12
N$26  (via drill 0.25)
  Top 0.152: v69.53,93.66 71.44,95.57 98.74,95.57 RN8.8
  Bottom 0.152: v69.53,93.66 IC4.11 | RN8.8 U$1.23
N$27
  Top 0.152: IC4.12 66.36,89.85 92.71,89.85 94.61,91.76 100.65,91.76 RN8.9
  Bottom 0.152: RN8.9 U$1.24
N$28
  Bottom 0.152: U$1.1 85.09,107.95 RN7.9 82.55,112.71 113.35,112.71 IC18.12
N$29
  Top 0.152: IC18.11 116.52,112.08 86.68,112.08 RN7.8
  Bottom 0.152: RN7.8 87.63,107.95 U$1.2
N$30
  Top 0.152: IC18.6 118.43,107.63 110.17,107.63 108.9,108.9 89.22,108.9 RN7.7
  Bottom 0.152: RN7.7 90.17,107.95 U$1.3
N$31
  Top 0.152: IC18.5 118.11,105.41 104.46,105.41 103.19,106.68 93.98,106.68 U$1.4
  Bottom 0.152: RN7.6 92.71,107.95 U$1.4
N$32
  Bottom 0.152: RN7.2 102.87,107.95 U$1.8 104.78,103.5 104.78,101.6 IC18.1
N$33  (2 unrouted)
N$34
  Bottom 0.152: RN7.3 100.33,107.95 U$1.7 100.33,104.14 103.19,104.14 104.14,103.19 104.14,100.01 112.71,100.01 IC18.2
N$35
  Bottom 0.152: U$1.6 97.79,107.95 RN7.4 95.25,112.08 106.36,112.08 IC18.3
N$36
  Top 0.152: IC7.7 73.98,96.2 102.23,96.2 104.14,98.11 104.14,102.87 U$1.16
N$37  (via drill 0.25)
  Top 0.152: v79.38,100.97 81.28,99.06 98.11,99.06 99.06,100.01 99.06,102.87 U$1.15
  Bottom 0.152: v79.38,100.97 IC7.9
N$38
  Bottom 0.152: IC7.10 77.47,100.33 83.82,100.33 83.82,100.65 84.77,101.6 97.79,101.6 U$1.14
N$39
  Top 0.152: IC7.11 71.44,107 90.17,107 91.44,105.73 91.44,104.14 93.98,104.14 U$1.13
N$40
  Bottom 0.152: IC7.12 68.9,107 83.82,107 83.82,105.09 84.77,104.14 92.71,104.14 U$1.12
N$41
  Top 0.152: IC7.13 66.36,103.82 84.45,103.82 84.77,104.14 88.9,104.14 U$1.11
N$42
  Top 0.152: IC7.14 62.23,101.6 86.36,101.6 U$1.10
N$43
  Top 0.152: IC7.15 61.28,107 62.87,107 63.82,106.05 63.82,102.87 U$1.9
N$44
  Top 0.152: IC18.4 117.79,103.19 110.17,103.19 109.86,102.87 105.09,102.87 103.82,104.14 96.52,104.14 U$1.5
  Bottom 0.152: RN7.5 95.25,107.95 U$1.5
N$47  (2 unrouted)
VCC  (56 unrouted)
  pour Route15: 0,113.03 176.53,113.03 176.53,0 0,0 0,8.89 6.35,8.89 6.35,16.51 0,16.51 0,97.79 6.35,97.79 6.35,105.41 0,105.41

### Text on the board
tNames: -BUS-EN | Gnd | YACC1 MEMORY BOARD V1.3 | 0 | onepagecomputer.com